# Altium project 1166V10.PrjPCB (part 1 of 2)
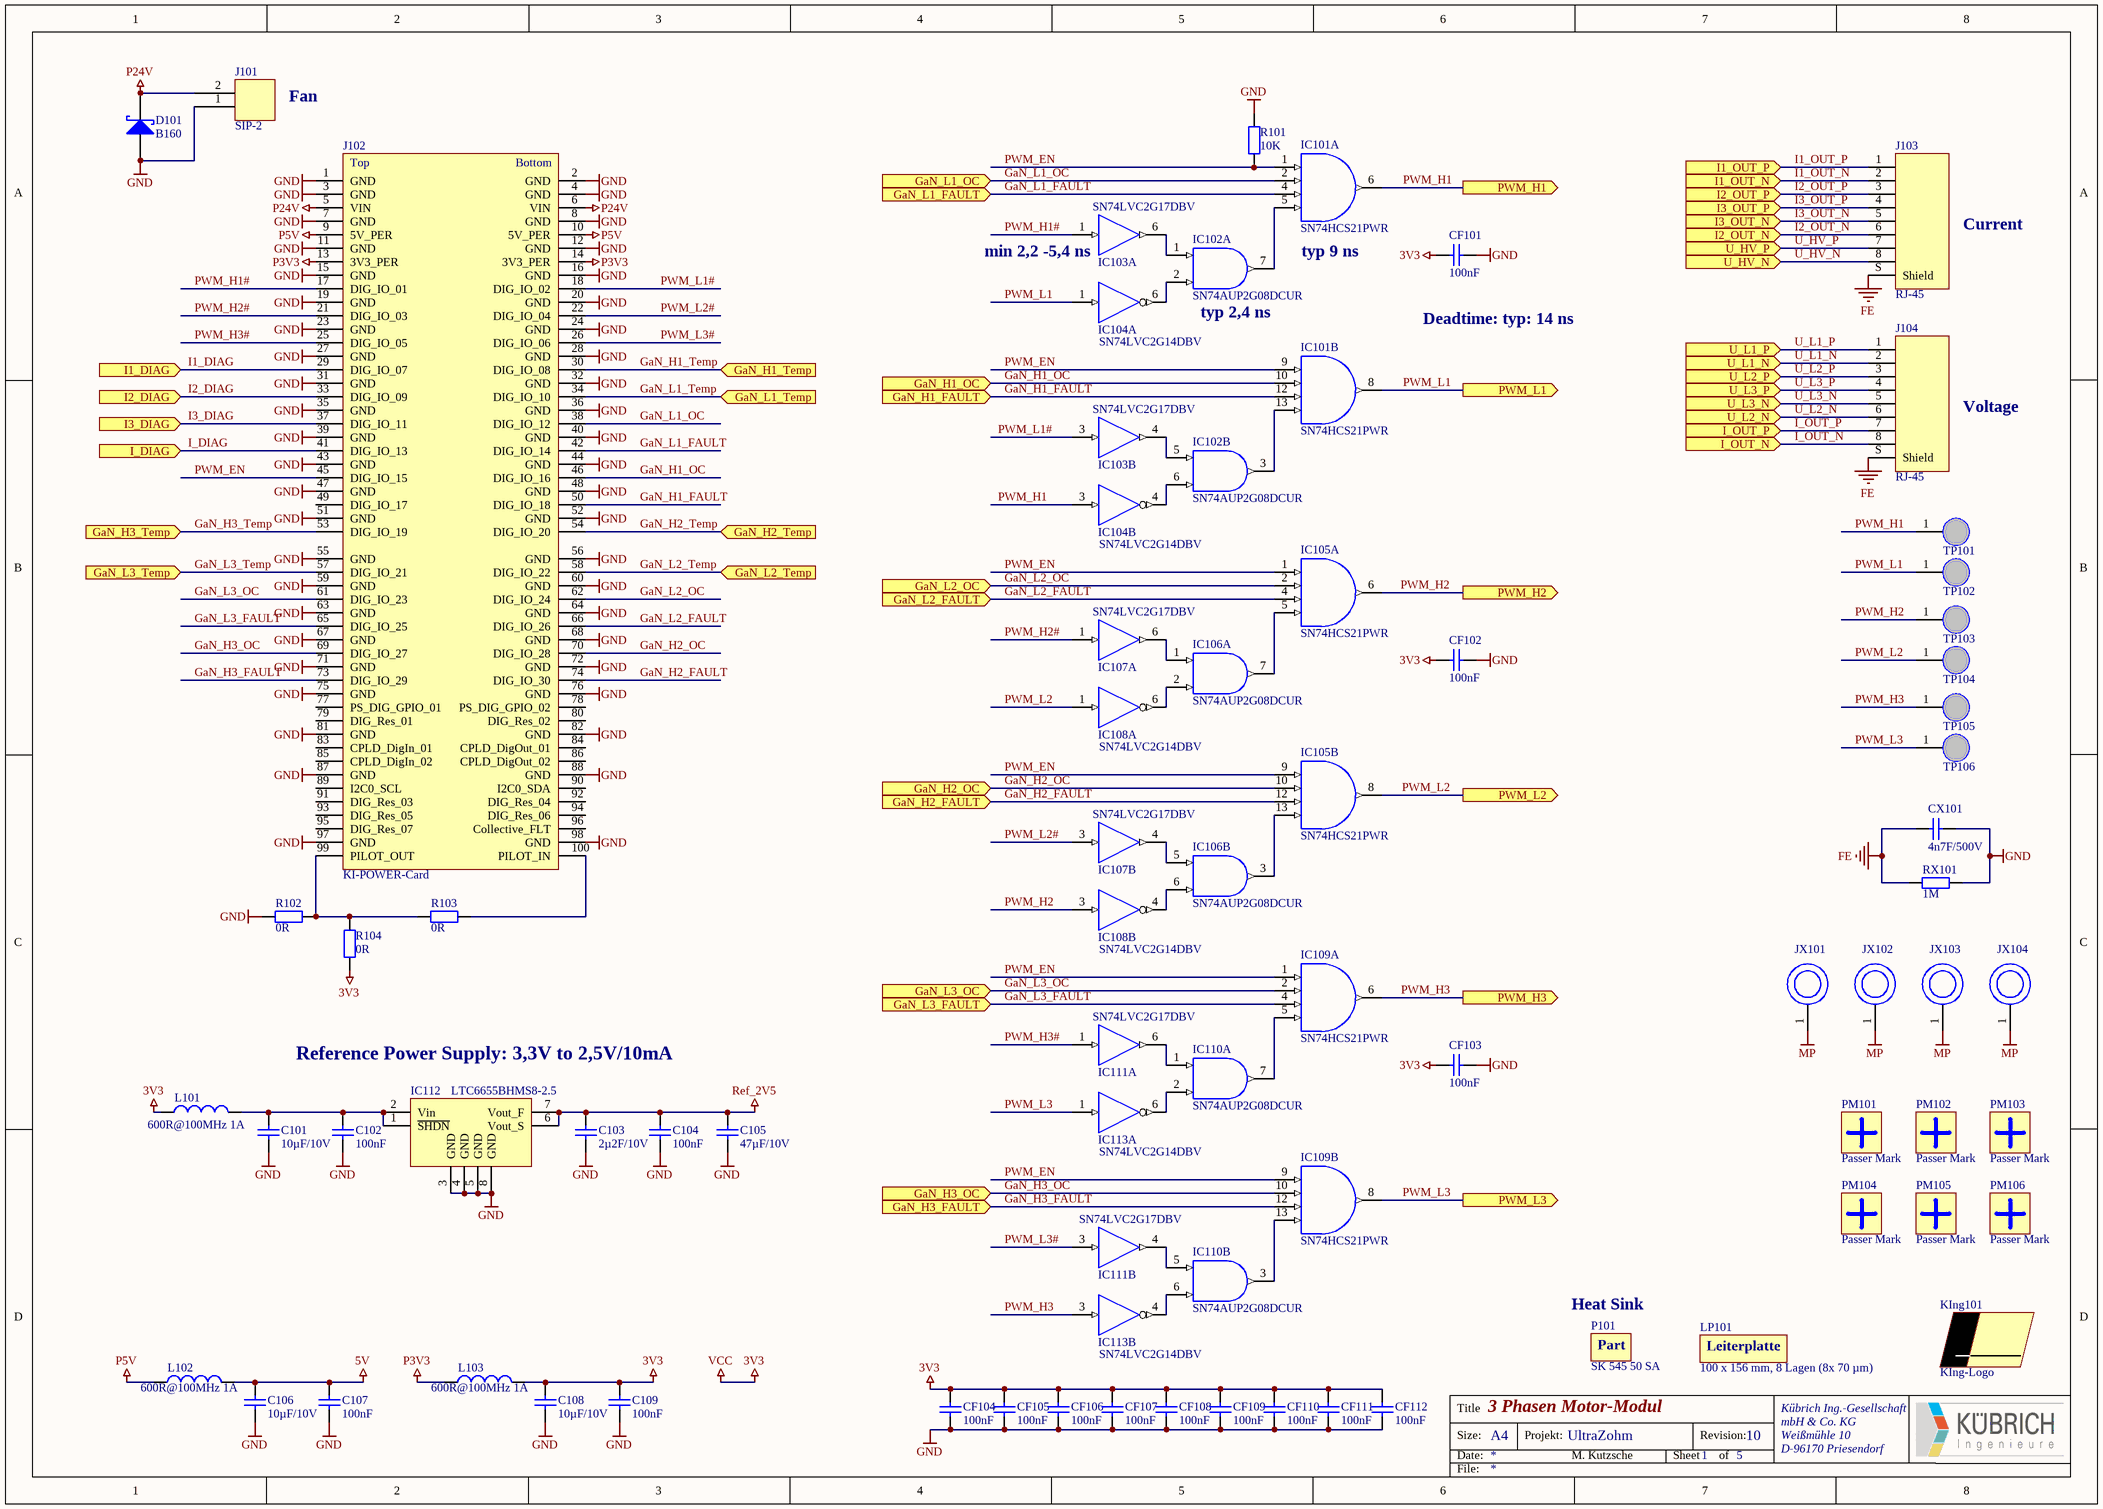
[diagram p0: 1166V10-1.SchDoc]
5 sheets, 455 parts. Net scope: flat (ports and power ports of the same name join across sheets).
Board file: 1166V10.PcbDoc
Sheets:
  1166V10-1.SchDoc
  1166V10-2.SchDoc
  1166V10-3.SchDoc
  1166V10-4.SchDoc
  1166V10-5.SchDoc

## Sheet 1166V10-1.SchDoc: 3 Phasen Motor-Modul
size A3; Author: M. Kutzsche; Organization: Kübrich Ing.-Gesellschaft; Address1: mbH & Co. KG; Address2: Weißmühle 10; Address3: D-96170 Priesendorf; DocumentNumber: UltraZohm; Revision: 10; SheetNumber: 1; SheetTotal: 5

### Parts
C101  10µF/10V  [0805-Cap]
C102  100nF  [0603-Cap]
C103  2µ2F/10V  [0805-Cap]
C104  100nF  [0603-Cap]
C105  47µF/10V  [1210-Cap]
C106  10µF/10V  [0603-Cap]
C107  100nF  [0603-Cap]
C108  10µF/10V  [0603-Cap]
C109  100nF  [0603-Cap]
CF101  100nF  [0603-Cap]
CF102  100nF  [0603-Cap]
CF103  100nF  [0603-Cap]
CF104  100nF  [0603-Cap]
CF105  100nF  [0603-Cap]
CF106  100nF  [0603-Cap]
CF107  100nF  [0603-Cap]
CF108  100nF  [0603-Cap]
CF109  100nF  [0603-Cap]
CF110  100nF  [0603-Cap]
CF111  100nF  [0603-Cap]
CF112  100nF  [0603-Cap]
CX101  4n7F/500V  [1206-Cap]
D101  B160  [SMA]
IC101  SN74HCS21PWR  [TSSOP-14]  (parts A,B of 2)
IC102  SN74AUP2G08DCUR  [VSSOP-8]  (parts A,B of 2)
IC103  SN74LVC2G17DBV  [SOT-23-6]  (parts A,B of 2)
IC104  SN74LVC2G14DBV  [SOT-23-6]  (parts A,B of 2)
IC105  SN74HCS21PWR  [TSSOP-14]  (parts A,B of 2)
IC106  SN74AUP2G08DCUR  [VSSOP-8]  (parts A,B of 2)
IC107  SN74LVC2G17DBV  [SOT-23-6]  (parts A,B of 2)
IC108  SN74LVC2G14DBV  [SOT-23-6]  (parts A,B of 2)
IC109  SN74HCS21PWR  [TSSOP-14]  (parts A,B of 2)
IC110  SN74AUP2G08DCUR  [VSSOP-8]  (parts A,B of 2)
IC111  SN74LVC2G17DBV  [SOT-23-6]  (parts A,B of 2)
IC112  LTC6655BHMS8-2.5  [MSOP-8 (RM-8)]
IC113  SN74LVC2G14DBV  [SOT-23-6]  (parts A,B of 2)
J101  SIP-2  [SIP-2]
J102  KI-POWER-Card  [KI-POWER-CARD]
J103  RJ-45  [WE-634008149821]
J104  RJ-45  [WE-634008149821]
JX101  Drill PAD  [PAD-6.0/3.2]  (value not drawn)  (no BOM)
JX102  Drill PAD  [PAD-6.0/3.2]  (value not drawn)  (no BOM)
JX103  Drill PAD  [PAD-6.0/3.2]  (value not drawn)  (no BOM)
JX104  Drill PAD  [PAD-6.0/3.2]  (value not drawn)  (no BOM)
KIng101  KIng-Logo  [King_Logo 900x300mil short]  (no BOM)
L101  600R@100MHz 1A  [0603-Ind]
L102  600R@100MHz 1A  [0603-Ind]
L103  600R@100MHz 1A  [0603-Ind]
LP101  100 x 156 mm, 8 Lagen (8x 70 µm)  [LP]
P101  SK 545 50 SA  [Part]
PM101  Passer Mark  [PASSER-MARK Rund 1,2mm]
PM102  Passer Mark  [PASSER-MARK Rund 1,2mm]
PM103  Passer Mark  [PASSER-MARK Rund 1,2mm]
PM104  Passer Mark  [PASSER-MARK Rund 1,2mm]
PM105  Passer Mark  [PASSER-MARK Rund 1,2mm]
PM106  Passer Mark  [PASSER-MARK Rund 1,2mm]
R101  10K  [0603-Res]
R102  0R  [0603-Res]
R103  0R  [0603-Res]
R104  0R  [0603-Res]
RX101  1M  [1206-Res]
TP101  Test-Point  [PAD-1.0/1.8]  (value not drawn)  (no BOM)
TP102  Test-Point  [PAD-1.0/1.8]  (value not drawn)  (no BOM)
TP103  Test-Point  [PAD-1.0/1.8]  (value not drawn)  (no BOM)
TP104  Test-Point  [PAD-1.0/1.8]  (value not drawn)  (no BOM)
TP105  Test-Point  [PAD-1.0/1.8]  (value not drawn)  (no BOM)
TP106  Test-Point  [PAD-1.0/1.8]  (value not drawn)  (no BOM)

### Ports
GaN_H1_FAULT (in), GaN_H1_OC (in), GaN_H1_Temp (in), GaN_H2_FAULT (in), GaN_H2_OC (in), GaN_H2_Temp (in), GaN_H3_FAULT (in), GaN_H3_OC (in), GaN_H3_Temp (in), GaN_L1_FAULT (in), GaN_L1_OC (in), GaN_L1_Temp (in), GaN_L2_FAULT (in), GaN_L2_OC (in), GaN_L2_Temp (in), GaN_L3_FAULT (in), GaN_L3_OC (in), GaN_L3_Temp (in), I1_DIAG (in), I1_OUT_N (in), I1_OUT_P (in), I2_DIAG (in), I2_OUT_N (in), I2_OUT_P (in), I3_DIAG (in), I3_OUT_N (in), I3_OUT_P (in), I_DIAG (in), I_OUT_N (in), I_OUT_P (in), PWM_H1 (out), PWM_H2 (out), PWM_H3 (out), PWM_L1 (out), PWM_L2 (out), PWM_L3 (out), U_HV_N (in), U_HV_P (in), U_L1_N (in), U_L1_P (in), U_L2_N (in), U_L2_P (in), U_L3_N (in), U_L3_P (in)

### Nets
3V3: C108.2 C109.2 CF101.2 CF102.2 CF103.2 CF104.1 CF105.1 CF106.1 CF107.1 CF108.1 CF109.1 CF110.1 CF111.1 CF112.1 IC101.14(VCC) IC102.8(VCC) IC103.5(VCC) IC104.5(VCC) IC105.14(VCC) IC106.8(VCC) IC107.5(VCC) IC108.5(VCC) IC109.14(VCC) IC110.8(VCC) IC111.5(VCC) IC113.5(VCC) L101.1 L103.2 R104.1  [also labelled VCC]
5V: C106.2 C107.2 L102.2
FE: CX101.1 J103.S(Shield) J104.S(Shield) RX101.1
GND: C101.1 C102.1 C103.1 C104.1 C105.1 C106.1 C107.1 C108.1 C109.1 CF101.1 CF102.1 CF103.1 CF104.2 CF105.2 CF106.2 CF107.2 CF108.2 CF109.2 CF110.2 CF111.2 CF112.2 CX101.2 D101.1(A) IC101.7(GND) IC102.4(GND) IC103.2(GND) IC104.2(GND) IC105.7(GND) IC106.4(GND) IC107.2(GND) IC108.2(GND) IC109.7(GND) IC110.4(GND) IC111.2(GND) IC112.3(GND) IC112.4(GND) IC112.5(GND) IC112.8(GND) IC113.2(GND) J101.1 J102.1(GND) J102.2(GND) J102.3(GND) J102.4(GND) J102.7(GND) J102.8(GND) J102.11(GND) J102.12(GND) J102.15(GND) J102.16(GND) J102.19(GND) J102.20(GND) J102.23(GND) J102.24(GND) J102.27(GND) J102.28(GND) J102.31(GND) J102.32(GND) J102.35(GND) J102.36(GND) J102.39(GND) J102.40(GND) J102.43(GND) J102.44(GND) J102.47(GND) J102.48(GND) J102.51(GND) J102.52(GND) J102.55(GND) J102.56(GND) J102.59(GND) J102.60(GND) J102.63(GND) J102.64(GND) J102.67(GND) J102.68(GND) J102.71(GND) J102.72(GND) J102.75(GND) J102.76(GND) J102.81(GND) J102.82(GND) J102.87(GND) J102.88(GND) J102.97(GND) J102.98(GND) R101.2 R102.1 RX101.2
MP: JX101.1 JX102.1 JX103.1 JX104.1
P3V3: J102.13(3V3_PER) J102.14(3V3_PER) L103.1
P5V: J102.9(5V_PER) J102.10(5V_PER) L102.1
P24V: D101.2(K) J101.2 J102.5(VIN) J102.6(VIN)
Ref_2V5: C103.2 C104.2 C105.2 IC112.6(Vout_S) IC112.7(Vout_F)
GaN_H1_FAULT: IC101.12(C2) J102.50(DIG_IO_18) ; port GaN_H1_FAULT
GaN_H1_OC: IC101.10(B2) J102.46(DIG_IO_16) ; port GaN_H1_OC
GaN_H1_Temp: J102.30(DIG_IO_08) ; port GaN_H1_Temp
GaN_H2_FAULT: IC105.12(C2) J102.74(DIG_IO_30) ; port GaN_H2_FAULT
GaN_H2_OC: IC105.10(B2) J102.70(DIG_IO_28) ; port GaN_H2_OC
GaN_H2_Temp: J102.54(DIG_IO_20) ; port GaN_H2_Temp
GaN_H3_FAULT: IC109.12(C2) J102.73(DIG_IO_29) ; port GaN_H3_FAULT
GaN_H3_OC: IC109.10(B2) J102.69(DIG_IO_27) ; port GaN_H3_OC
GaN_H3_Temp: J102.53(DIG_IO_19) ; port GaN_H3_Temp
GaN_L1_FAULT: IC101.4(C1) J102.42(DIG_IO_14) ; port GaN_L1_FAULT
GaN_L1_OC: IC101.2(B1) J102.38(DIG_IO_12) ; port GaN_L1_OC
GaN_L1_Temp: J102.34(DIG_IO_10) ; port GaN_L1_Temp
GaN_L2_FAULT: IC105.4(C1) J102.66(DIG_IO_26) ; port GaN_L2_FAULT
GaN_L2_OC: IC105.2(B1) J102.62(DIG_IO_24) ; port GaN_L2_OC
GaN_L2_Temp: J102.58(DIG_IO_22) ; port GaN_L2_Temp
GaN_L3_FAULT: IC109.4(C1) J102.65(DIG_IO_25) ; port GaN_L3_FAULT
GaN_L3_OC: IC109.2(B1) J102.61(DIG_IO_23) ; port GaN_L3_OC
GaN_L3_Temp: J102.57(DIG_IO_21) ; port GaN_L3_Temp
I1_DIAG: J102.29(DIG_IO_07) ; port I1_DIAG
I1_OUT_N: J103.2 ; port I1_OUT_N
I1_OUT_P: J103.1 ; port I1_OUT_P
I2_DIAG: J102.33(DIG_IO_09) ; port I2_DIAG
I2_OUT_N: J103.6 ; port I2_OUT_N
I2_OUT_P: J103.3 ; port I2_OUT_P
I3_DIAG: J102.37(DIG_IO_11) ; port I3_DIAG
I3_OUT_N: J103.5 ; port I3_OUT_N
I3_OUT_P: J103.4 ; port I3_OUT_P
I_DIAG: J102.41(DIG_IO_13) ; port I_DIAG
I_OUT_N: J104.8 ; port I_OUT_N
I_OUT_P: J104.7 ; port I_OUT_P
PWM_EN: IC101.1(A1) IC101.9(A2) IC105.1(A1) IC105.9(A2) IC109.1(A1) IC109.9(A2) J102.45(DIG_IO_15) R101.1
PWM_H1: IC101.6(O1) IC104.3(2A) TP101.1 ; port PWM_H1
PWM_H1#: IC103.1(1A) J102.17(DIG_IO_01)
PWM_H2: IC105.6(O1) IC108.3(2A) TP103.1 ; port PWM_H2
PWM_H2#: IC107.1(1A) J102.21(DIG_IO_03)
PWM_H3: IC109.6(O1) IC113.3(2A) TP105.1 ; port PWM_H3
PWM_H3#: IC111.1(1A) J102.25(DIG_IO_05)
PWM_L1: IC101.8(O2) IC104.1(1A) TP102.1 ; port PWM_L1
PWM_L1#: IC103.3(2A) J102.18(DIG_IO_02)
PWM_L2: IC105.8(O2) IC108.1(1A) TP104.1 ; port PWM_L2
PWM_L2#: IC107.3(2A) J102.22(DIG_IO_04)
PWM_L3: IC109.8(O2) IC113.1(1A) TP106.1 ; port PWM_L3
PWM_L3#: IC111.3(2A) J102.26(DIG_IO_06)
U_HV_N: J103.8 ; port U_HV_N
U_HV_P: J103.7 ; port U_HV_P
U_L1_N: J104.2 ; port U_L1_N
U_L1_P: J104.1 ; port U_L1_P
U_L2_N: J104.6 ; port U_L2_N
U_L2_P: J104.3 ; port U_L2_P
U_L3_N: J104.5 ; port U_L3_N
U_L3_P: J104.4 ; port U_L3_P
NetC101_2: C101.2 C102.2 IC112.1(~{SHDN}) IC112.2(Vin) L101.2
NetIC101_5: IC101.5(D1) IC102.7(1Y)
NetIC101_13: IC101.13(D2) IC102.3(2Y)
NetIC102_1: IC102.1(1A) IC103.6(1Y)
NetIC102_2: IC102.2(1B) IC104.6(1Y)
NetIC102_5: IC102.5(2A) IC103.4(2Y)
NetIC102_6: IC102.6(2B) IC104.4(2Y)
NetIC105_5: IC105.5(D1) IC106.7(1Y)
NetIC105_13: IC105.13(D2) IC106.3(2Y)
NetIC106_1: IC106.1(1A) IC107.6(1Y)
NetIC106_2: IC106.2(1B) IC108.6(1Y)
NetIC106_5: IC106.5(2A) IC107.4(2Y)
NetIC106_6: IC106.6(2B) IC108.4(2Y)
NetIC109_5: IC109.5(D1) IC110.7(1Y)
NetIC109_13: IC109.13(D2) IC110.3(2Y)
NetIC110_1: IC110.1(1A) IC111.6(1Y)
NetIC110_2: IC110.2(1B) IC113.6(1Y)
NetIC110_5: IC110.5(2A) IC111.4(2Y)
NetIC110_6: IC110.6(2B) IC113.4(2Y)
NetJ102_99: J102.99(PILOT_OUT) R102.2 R103.1 R104.2
NetJ102_100: J102.100(PILOT_IN) R103.2

Not connected (* = marked no-connect by the designer): J102 49(DIG_IO_17) 77(PS_DIG_GPIO_01) 78(PS_DIG_GPIO_02) 79(DIG_Res_01) 80(DIG_Res_02) 83(CPLD_DigIn_01) 84(CPLD_DigOut_01) 85(CPLD_DigIn_02) 86(CPLD_DigOut_02) 89(I2C0_SCL) 90(I2C0_SDA) 91(DIG_Res_03) 92(DIG_Res_04) 93(DIG_Res_05) 94(DIG_Res_06) 95(DIG_Res_07) 96(Collective_FLT)

### Notes on the sheet
- Fan
- Current
- (near IC103) min 2,2 -5,4 ns
- (near IC102) typ 2,4 ns
- typ 9 ns
- Deadtime: typ: 14 ns
- Voltage
- Reference Power Supply: 3,3V to 2,5V/10mA
- Heat Sink
- Title
- Size:
- Date:
- A4
- Projekt:
- Sheet
- Revision:
- of
- File:
- (in symbol KI-POWER-Card) Top; Bottom

### Library data of the parts
C101-C109 CF101-CF112 CX101 = Cap_SMD: Capacitor (SMD); Class I: Pasiv; Class II: Capacitor; Last edited: 20.11.2006 10:25
  C101 C106 C108: value: 10µF/10V
  C102 C104 C107 C109 CF101-CF112: value: 100nF
  C103: value: 2µ2F/10V
  C105: value: 47µF/10V
  CX101: value: 4n7F/500V
D101 = B160: Schottky Barrier Rectifier Vr=60V If=1A; Manufacturer: General Semiconductor; Class II: Schottky Earrier Rectifier Vr=60V If=1A; Class I: Discret; Package information: Unknown; Best.-Nr.: Farnell 145-6528RL; Datasheet: Ver. 7 Nov 2000; Package reference: DO-214AC (SMA)
IC101 IC105 IC109 = SN74HCS21PWR: Dual 4-Input AND Gate with Schmitt Trigger Input; Manufacturer: Texas Instrument; Package Information: Unknown; Class I: Logic; Best.-Nr.: DigiKey: 296-SN74HCS21PWRCT-ND; Datasheet: SCES200J; Package Reference: TSSOP-14; Class II: Gate
IC102 IC106 IC110 = SN74AUP2G08DCUR: (VSSOP) Dual 2-Input Positive AND Gate; Manufacturer: Texas Instrument; Package Information: Unknown; Class I: Logic; Datasheet: SCES193J, Rev. Sep 2003; Package Reference: VSSOP-8; Class II: Dual 2-Input Positive AND Gate
IC103 IC107 IC111 = SN74LVC2G17D_: Dual Buffer with Schmitt Trigger Input; Manufacturer: Texas Instrument; Class I: Logic; value121: SN74LVC2G17DCK; Best.-Nr.: Farnell 147-0776 (SOT23-6), 128-7569 (SC-70); Datasheet: SCES381E, Rev. Sep 2003; Class II: Dual Buffer with Schmitt Trigger Input; value111: SN74LVC2G17DBV; Last edited: 22.01.2007 11:08
IC104 IC108 IC113 = SN74LVC2G14D_: Dual Inverter with Schmitt Trigger Input; Manufacturer: Texas Instrument; Class I: Logic; value121: SN74LVC2G14DCK; Datasheet: SCES200J; Class II: Dual Inverter with Schmitt Trigger Input; value111: SN74LVC2G14DBV; Last edited: 22.01.2007 11:08
IC112 = LTC6655BHMS8-2.5: Voltage References 2,5V, 2ppm/°C, Low Noise 0,25ppm; Manufacturer: Linear Technology; Class I: Discret; Package information: Unknown; Best.-Nr.: Farnell 229-5508; Class II: Voltage References 2,5V, 2ppm/°C, Low Noise 0,25ppm; Datasheet: Unknown; Package reference: MSOP-8
J101 = SIP-2: Single In-line Connector 2 pin; Class I: Connectors; Class II: Single In-line Connector 2 pin; Last edited: 08.12.2006 17:09
J102 = KI-POWER-Card: Einsteckkarte für KI-POWER Projekt (Ultra ZYNQ); Manufacturer: Samtec; Class I: Connectors; Best.-Nr.: Gegenstecker: Samtec HSEC8-150-01-XX-DV-A-BL; Class II: Einsteckkarte für KI-POWER Projekt (Ultra ZYNQ); Datasheet: 2000/1; Last edited: 07.09.2020 13:28
J103 J104 = WE-634008149821: SMD CAT3 RJ-45 Connector; Manufacturer: Würth Elektronik; Class I: Connectors; Class II: RJ-45 Connector; Package reference: WE-634008149821; Datasheet: Unknown; Best.-Nr.: WE-634008149821
JX101-JX104 = Drill PAD: PAD
KIng101 = KIng-Logo: Kuebrich-Ing. Logo
L101-L103 = WE-742792651: Ferrite SMD 600R@100MHz 1A (0603); Manufacturer: Wuerth-Elektronik; Class I: Pasive; Class II: Ferrite SMD 600R@100MHz 1A; Last edited: 08.12.2006 12:28; Best.-Nr.: WE-742792651
LP101 = Leiterplatte: Leiterplatte 100 x 156 mm, 8 Lagen (8x 70 µm); Manufacturer: Generic Manufacturer; Footprint: Größe 100 x 156 mm
P101 = Part: Kühlkörper 80x50x10 mm; Manufacturer: Fischer Elektronik; Best.-Nr.: SK 545 50 SA
R101-R104 RX101 = Res_SMD: Resistor SMD; Class I: Pasiv; Class II: Resistor; Last edited: 17.11.2006 11:38
  R101: value: 10K
  R102-R104: value: 0R
  RX101: value: 1M
TP101-TP106 = Test-Point: PAD

## Sheet 1166V10-2.SchDoc: Half-Bridge Phase 1
size A3; Author: M. Kutzsche; Organization: Kübrich Ing.-Gesellschaft; Address1: mbH & Co. KG; Address2: Weißmühle 10; Address3: D-96170 Priesendorf; DocumentNumber: UltraZohm; Revision: 10; SheetNumber: 2; SheetTotal: 5
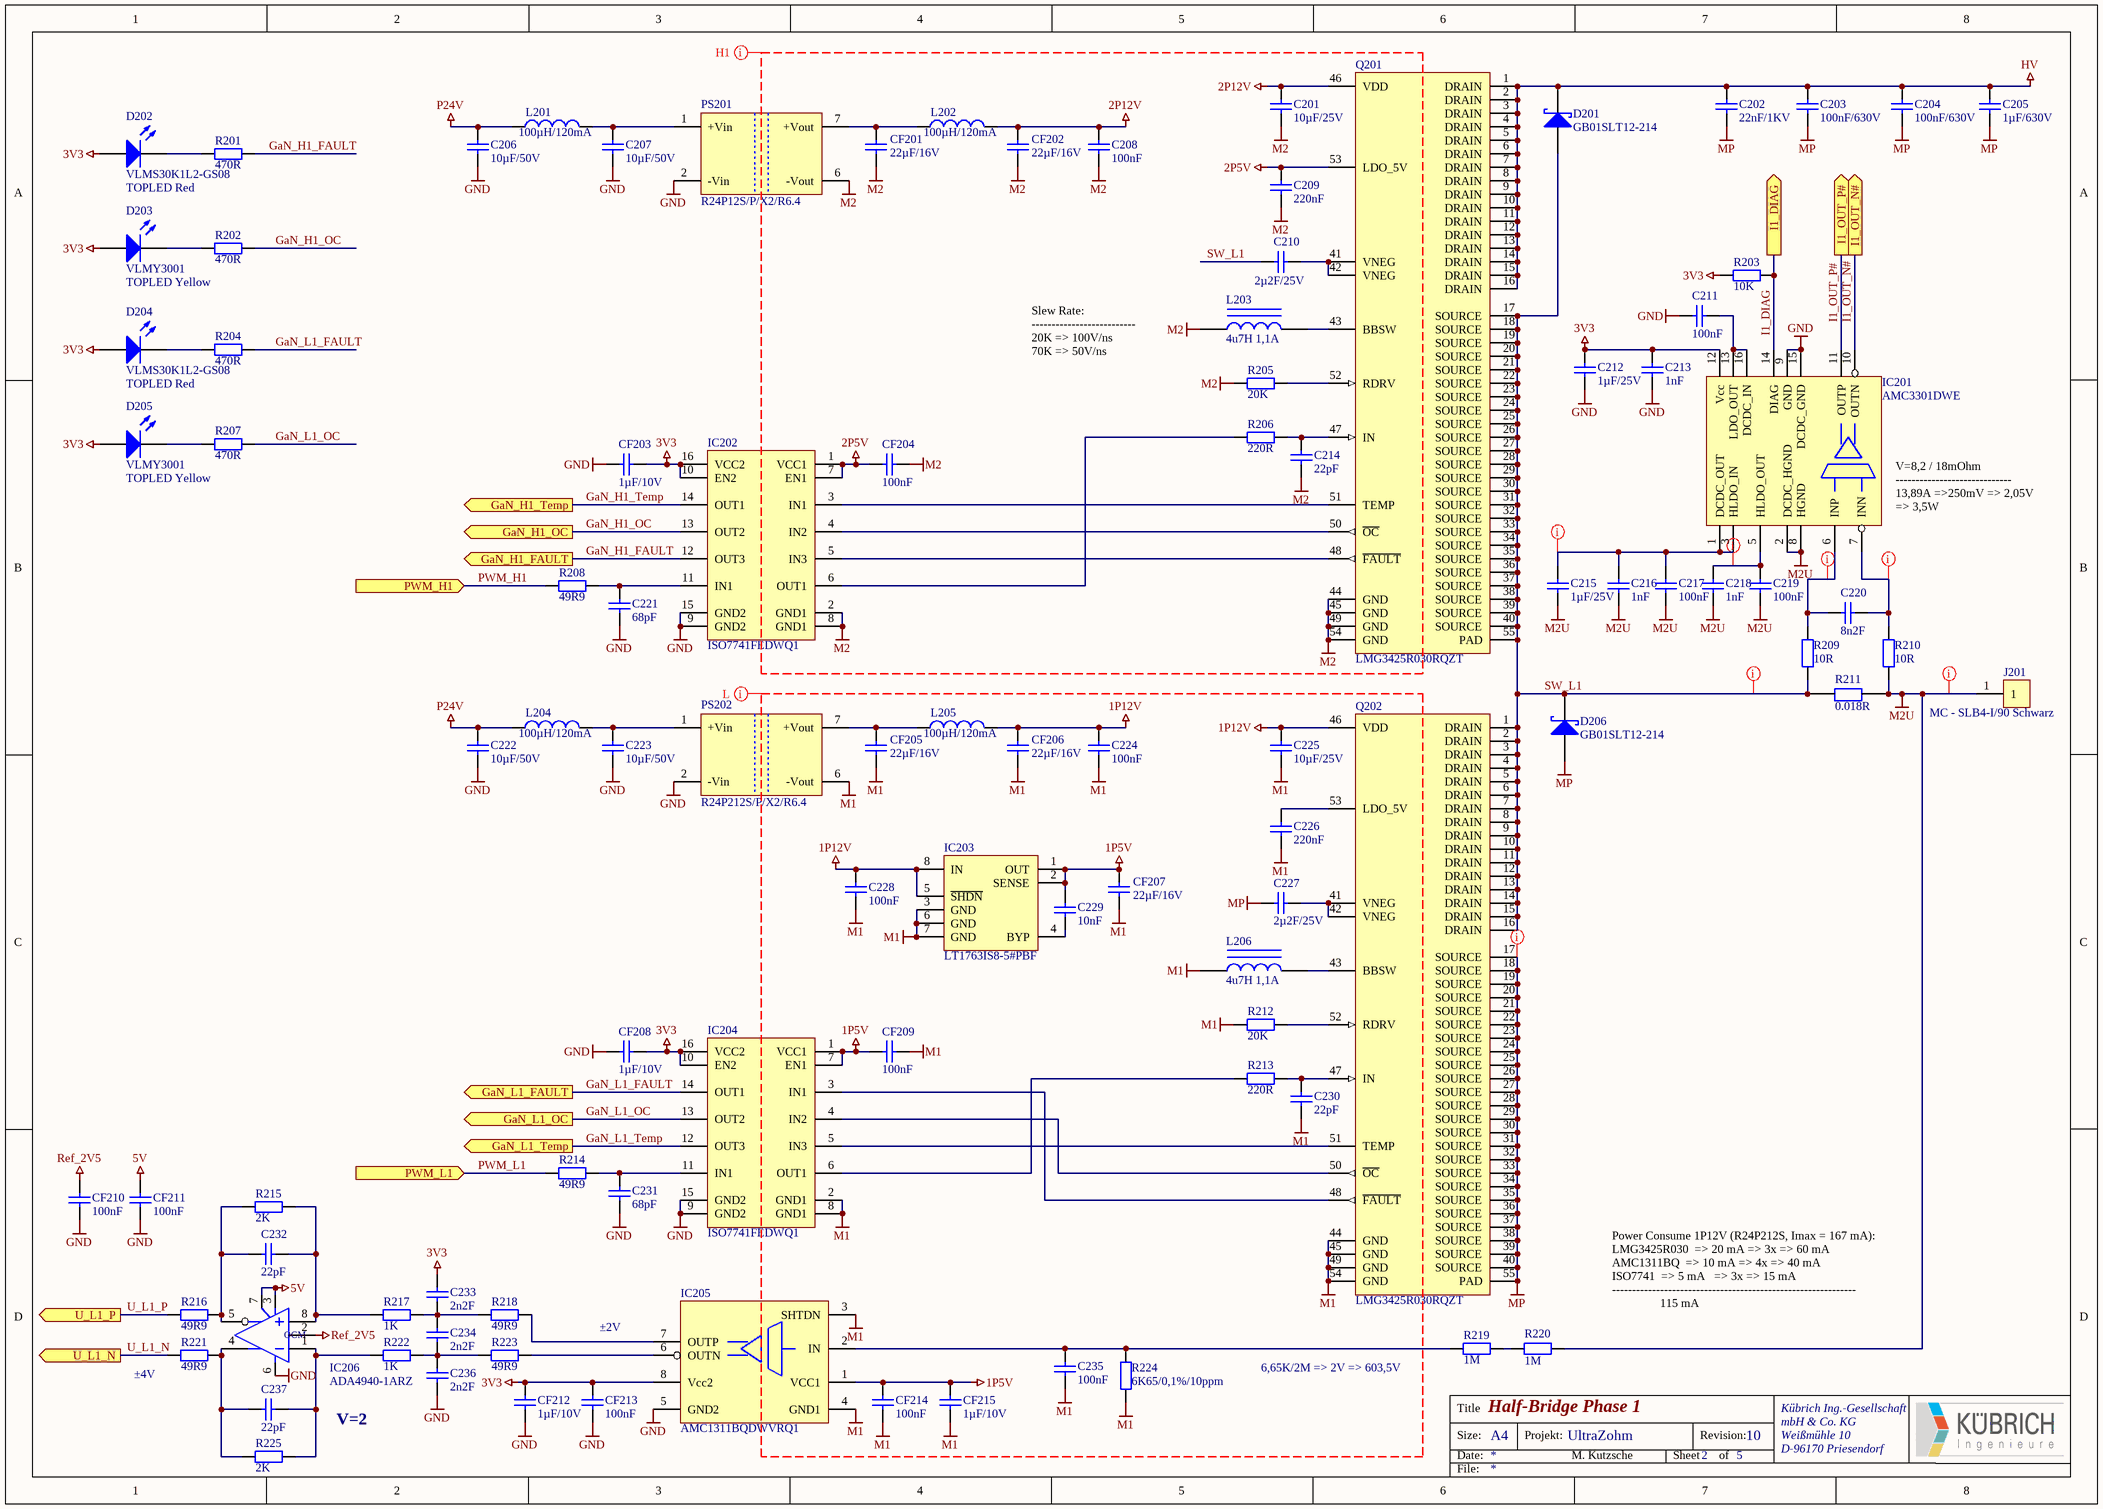
[diagram p1: 1166V10-2.SchDoc]

### Parts
C201  10µF/25V  [0805-Cap]
C202  22nF/1KV  [2220-Cap]
C203  100nF/630V  [2220-Cap]
C204  100nF/630V  [2220-Cap]
C205  1µF/630V  [2220-Cap]
C206  10µF/50V  [1206-Cap]
C207  10µF/50V  [1206-Cap]
C208  100nF  [0603-Cap]
C209  220nF  [0603-Cap]
C210  2µ2F/25V  [0805-Cap]
C211  100nF  [0603-Cap]
C212  1µF/25V  [1206-Cap]
C213  1nF  [1206-Cap]
C214  22pF  [0603-Cap]
C215  1µF/25V  [0603-Cap]
C216  1nF  [0603-Cap]
C217  100nF  [0603-Cap]
C218  1nF  [1206-Cap]
C219  100nF  [1206-Cap]
C220  8n2F  [0603-Cap]
C221  68pF  [0603-Cap]
C222  10µF/50V  [1206-Cap]
C223  10µF/50V  [1206-Cap]
C224  100nF  [0603-Cap]
C225  10µF/25V  [0805-Cap]
C226  220nF  [0603-Cap]
C227  2µ2F/25V  [0805-Cap]
C228  100nF  [0603-Cap]
C229  10nF  [0603-Cap]
C230  22pF  [0603-Cap]
C231  68pF  [0603-Cap]
C232  22pF  [0603-Cap]
C233  2n2F  [0603-Cap]
C234  2n2F  [0603-Cap]
C235  100nF  [0603-Cap]
C236  2n2F  [0603-Cap]
C237  22pF  [0603-Cap]
CF201  22µF/16V  [0805-Cap]
CF202  22µF/16V  [0805-Cap]
CF203  1µF/10V  [0603-Cap]
CF204  100nF  [0603-Cap]
CF205  22µF/16V  [0805-Cap]
CF206  22µF/16V  [0805-Cap]
CF207  22µF/16V  [0805-Cap]
CF208  1µF/10V  [0603-Cap]
CF209  100nF  [0603-Cap]
CF210  100nF  [0603-Cap]
CF211  100nF  [0603-Cap]
CF212  1µF/10V  [0603-Cap]
CF213  100nF  [0603-Cap]
CF214  100nF  [0603-Cap]
CF215  1µF/10V  [0603-Cap]
D201  GB01SLT12-214  [DO-214 (SMB)]
D202  VLMS30K1L2-GS08  Class II: TOPLED Red  [PLCC-2_rot]
D203  VLMY3001  Class II: TOPLED Yellow  [PLCC-2_gelb]
D204  VLMS30K1L2-GS08  Class II: TOPLED Red  [PLCC-2_rot]
D205  VLMY3001  Class II: TOPLED Yellow  [PLCC-2_gelb]
D206  GB01SLT12-214  [DO-214 (SMB)]
IC201  AMC3301DWE  [SOIC-16-W - 8.1mm]
IC202  ISO7741FEDWQ1  [SOIC-16-W - 8.1mm]
IC203  LT1763IS8-5#PBF  [SOIC-8-N]
IC204  ISO7741FEDWQ1  [SOIC-16-W - 8.1mm]
IC205  AMC1311BQDWVRQ1  [SOIC-8-W]
IC206  ADA4940-1ARZ  [SOIC-8-N]
J201  MC - SLB4-I/90 Schwarz  [SLB4-I/90 - 4mm]
L201  100µH/120mA  [1007-IND (2518)]
L202  100µH/120mA  [1007-IND (2518)]
L203  4u7H 1,1A  [2.0mm x 1.6mm]
L204  100µH/120mA  [1007-IND (2518)]
L205  100µH/120mA  [1007-IND (2518)]
L206  4u7H 1,1A  [2.0mm x 1.6mm]
PS201  R24P12S/P/X2/R6.4  [SIP-7 Single - X2]
PS202  R24P212S/P/X2/R6.4  [SIP-7 Single - X2]
Q201  LMG3425R030RQZT  [VQFN-54 (RQZ0054)]
Q202  LMG3425R030RQZT  [VQFN-54 (RQZ0054)]
R201  470R  [0603-Res]
R202  470R  [0603-Res]
R203  10K  [0603-Res]
R204  470R  [0603-Res]
R205  20K  [0603-Res]
R206  220R  [0603-Res]
R207  470R  [0603-Res]
R208  49R9  [0603-Res]
R209  10R  [0603-Res]
R210  10R  [0603-Res]
R211  0.018R  [2512]
R212  20K  [0603-Res]
R213  220R  [0603-Res]
R214  49R9  [0603-Res]
R215  2K  [0603-Res]
R216  49R9  [0603-Res]
R217  1K  [0603-Res]
R218  49R9  [0603-Res]
R219  1M  [2512-Res]
R220  1M  [2512-Res]
R221  49R9  [0603-Res]
R222  1K  [0603-Res]
R223  49R9  [0603-Res]
R224  6K65/0,1%/10ppm  [0603-Res]
R225  2K  [0603-Res]

### Ports
GaN_H1_FAULT (out), GaN_H1_OC (out), GaN_H1_Temp (out), GaN_L1_FAULT (out), GaN_L1_OC (out), GaN_L1_Temp (out), I1_DIAG (out), I1_OUT_N# (out), I1_OUT_P# (out), PWM_H1 (in), PWM_L1 (in), U_L1_N (out), U_L1_P (out)

### Nets
1P5V: C229.1 CF207.1 CF209.2 CF214.1 CF215.1 IC203.1(OUT) IC203.2(SENSE) IC204.1(VCC1) IC204.7(EN1) IC205.1(VCC1)
1P12V: C224.1 C225.2 C228.1 CF206.1 IC203.5(~{SHDN}) IC203.8(IN) L205.2 Q202.46(VDD)
2P5V: C209.2 CF204.2 IC202.1(VCC1) IC202.7(EN1) Q201.53(LDO_5V)
2P12V: C201.2 C208.1 CF202.1 L202.2 Q201.46(VDD)
3V3: C212.1 C213.1 C233.2 CF203.1 CF208.1 CF212.1 CF213.1 D202.1(A) D203.1(A) D204.1(A) D205.1(A) IC201.12(Vcc) IC202.10(EN2) IC202.16(VCC2) IC204.10(EN2) IC204.16(VCC2) IC205.8(Vcc2) R203.2
5V: CF211.1 IC206.3(V+) IC206.7(EN)
GND: C206.1 C207.1 C211.1 C212.2 C213.2 C221.1 C222.1 C223.1 C231.1 C236.1 CF203.2 CF208.2 CF210.2 CF211.2 CF212.2 CF213.2 IC201.9(GND) IC201.15(DCDC_GND) IC202.9(GND2) IC202.15(GND2) IC204.9(GND2) IC204.15(GND2) IC205.5(GND2) IC206.6(V-) PS201.2(-Vin) PS202.2(-Vin)
HV: C202.1 C203.1 C204.1 C205.1 D201.2(K) Q201.1(DRAIN) Q201.2(DRAIN) Q201.3(DRAIN) Q201.4(DRAIN) Q201.5(DRAIN) Q201.6(DRAIN) Q201.7(DRAIN) Q201.8(DRAIN) Q201.9(DRAIN) Q201.10(DRAIN) Q201.11(DRAIN) Q201.12(DRAIN) Q201.13(DRAIN) Q201.14(DRAIN) Q201.15(DRAIN) Q201.16(DRAIN)
M1: C224.2 C225.1 C226.1 C228.2 C230.1 C235.1 CF205.2 CF206.2 CF207.2 CF209.1 CF214.2 CF215.2 IC203.3(GND) IC203.6(GND) IC203.7(GND) IC204.2(GND1) IC204.8(GND1) IC205.3(SHTDN) IC205.4(GND1) L206.1 PS202.6(-Vout) Q202.44(GND) Q202.45(GND) Q202.49(GND) Q202.54(GND) R212.2 R224.2
M2: C201.1 C208.2 C209.1 C214.1 CF201.2 CF202.2 CF204.1 IC202.2(GND1) IC202.8(GND1) L203.1 PS201.6(-Vout) Q201.44(GND) Q201.45(GND) Q201.49(GND) Q201.54(GND) R205.2
M2U: C215.2 C216.2 C217.2 C218.2 C219.2 IC201.2(DCDC_HGND) IC201.8(HGND) J201.1 R210.1 R211.2 R220.2
MP: C202.2 C203.2 C204.2 C205.2 C227.2 D206.1(A) Q202.17(SOURCE) Q202.18(SOURCE) Q202.19(SOURCE) Q202.20(SOURCE) Q202.21(SOURCE) Q202.22(SOURCE) Q202.23(SOURCE) Q202.24(SOURCE) Q202.25(SOURCE) Q202.26(SOURCE) Q202.27(SOURCE) Q202.28(SOURCE) Q202.29(SOURCE) Q202.30(SOURCE) Q202.31(SOURCE) Q202.32(SOURCE) Q202.33(SOURCE) Q202.34(SOURCE) Q202.35(SOURCE) Q202.36(SOURCE) Q202.37(SOURCE) Q202.38(SOURCE) Q202.39(SOURCE) Q202.40(SOURCE) Q202.55(PAD)
P24V: C206.2 C222.2 L201.1 L204.1
Ref_2V5: CF210.1 IC206.2(OCM)
GaN_H1_FAULT: IC202.12(OUT3) R201.2 ; port GaN_H1_FAULT
GaN_H1_OC: IC202.13(OUT2) R202.2 ; port GaN_H1_OC
GaN_H1_Temp: IC202.14(OUT1) ; port GaN_H1_Temp
GaN_L1_FAULT: IC204.14(OUT1) R204.2 ; port GaN_L1_FAULT
GaN_L1_OC: IC204.13(OUT2) R207.2 ; port GaN_L1_OC
GaN_L1_Temp: IC204.12(OUT3) ; port GaN_L1_Temp
I1_DIAG: IC201.14(DIAG) R203.1 ; port I1_DIAG
I1_OUT_N#: IC201.10(OUTN) ; port I1_OUT_N#
I1_OUT_P#: IC201.11(OUTP) ; port I1_OUT_P#
PWM_H1: R208.2 ; port PWM_H1
PWM_L1: R214.2 ; port PWM_L1
SW_L1: C210.1 D201.1(A) D206.2(K) Q201.17(SOURCE) Q201.18(SOURCE) Q201.19(SOURCE) Q201.20(SOURCE) Q201.21(SOURCE) Q201.22(SOURCE) Q201.23(SOURCE) Q201.24(SOURCE) Q201.25(SOURCE) Q201.26(SOURCE) Q201.27(SOURCE) Q201.28(SOURCE) Q201.29(SOURCE) Q201.30(SOURCE) Q201.31(SOURCE) Q201.32(SOURCE) Q201.33(SOURCE) Q201.34(SOURCE) Q201.35(SOURCE) Q201.36(SOURCE) Q201.37(SOURCE) Q201.38(SOURCE) Q201.39(SOURCE) Q201.40(SOURCE) Q201.55(PAD) Q202.1(DRAIN) Q202.2(DRAIN) Q202.3(DRAIN) Q202.4(DRAIN) Q202.5(DRAIN) Q202.6(DRAIN) Q202.7(DRAIN) Q202.8(DRAIN) Q202.9(DRAIN) Q202.10(DRAIN) Q202.11(DRAIN) Q202.12(DRAIN) Q202.13(DRAIN) Q202.14(DRAIN) Q202.15(DRAIN) Q202.16(DRAIN) R209.1 R211.1
U_L1_N: R221.2 ; port U_L1_N
U_L1_P: R216.2 ; port U_L1_P
NetC207_2: C207.2 L201.2 PS201.1(+Vin)
NetC210_2: C210.2 Q201.41(VNEG) Q201.42(VNEG)
NetC211_2: C211.2 IC201.13(LDO_OUT) IC201.16(DCDC_IN)
NetC214_2: C214.2 Q201.47(IN) R206.1
NetC215_1: C215.1 C216.1 C217.1 IC201.1(DCDC_OUT) IC201.3(HLDO_IN)
NetC218_1: C218.1 C219.1 IC201.5(HLDO_OUT)
NetC220_1: C220.1 IC201.7(INN) R210.2
NetC220_2: C220.2 IC201.6(INP) R209.2
NetC221_2: C221.2 IC202.11(IN1) R208.1
NetC223_2: C223.2 L204.2 PS202.1(+Vin)
NetC226_2: C226.2 Q202.53(LDO_5V)
NetC227_1: C227.1 Q202.41(VNEG) Q202.42(VNEG)
NetC229_2: C229.2 IC203.4(BYP)
NetC230_2: C230.2 Q202.47(IN) R213.1
NetC231_2: C231.2 IC204.11(IN1) R214.1
NetC232_1: C232.1 IC206.8(+) R215.1 R217.2
NetC232_2: C232.2 IC206.5(Out) R215.2 R216.1
NetC233_1: C233.1 C234.2 R217.1 R218.2
NetC234_1: C234.1 C236.2 R222.1 R223.2
NetC235_2: C235.2 IC205.2(IN) R219.1 R224.1
NetC237_1: C237.1 IC206.1(-) R222.2 R225.1
NetC237_2: C237.2 IC206.4(Out) R221.1 R225.2
NetCF201_1: CF201.1 L202.1 PS201.7(+Vout)
NetCF205_1: CF205.1 L205.1 PS202.7(+Vout)
NetD202_2: D202.2(K) R201.1
NetD203_2: D203.2(K) R202.1
NetD204_2: D204.2(K) R204.1
NetD205_2: D205.2(K) R207.1
NetIC202_3: IC202.3(IN1) Q201.51(TEMP)
NetIC202_4: IC202.4(IN2) Q201.50(~{OC})
NetIC202_5: IC202.5(IN3) Q201.48(~{FAULT})
NetIC202_6: IC202.6(OUT1) R206.2
NetIC204_3: IC204.3(IN1) Q202.48(~{FAULT})
NetIC204_4: IC204.4(IN2) Q202.50(~{OC})
NetIC204_5: IC204.5(IN3) Q202.51(TEMP)
NetIC204_6: IC204.6(OUT1) R213.2
NetIC205_6: IC205.6(OUTN) R223.1
NetIC205_7: IC205.7(OUTP) R218.1
NetL203_2: L203.2 Q201.43(BBSW)
NetL206_2: L206.2 Q202.43(BBSW)
NetQ201_52: Q201.52(RDRV) R205.1
NetQ202_52: Q202.52(RDRV) R212.1
NetR219_2: R219.2 R220.1

### Layout directives
net class H1: 2P5V, 2P12V, M2, M2U, NetC215_1, NetC218_1, NetC220_1, NetC220_2, SW_L1
net class L: 1P5V, 1P12V, M1, MP

### Notes on the sheet
- Slew Rate:
  --------------------------
  20K => 100V/ns
  70K => 50V/ns
- (near IC201) V=8,2 / 18mOhm
  -----------------------------
  13,89A =>250mV => 2,05V
  => 3,5W
- Power Consume 1P12V (R24P212S, Imax = 167 mA):
  LMG3425R030 	=> 20 mA => 3x => 60 mA
  AMC1311BQ 	=> 10 mA => 4x => 40 mA
  ISO7741		=> 5 mA   => 3x => 15 mA
  -------------------------------------------------------------
  115 mA
- (near R221) ±4V
- ±2V
- 6,65K/2M => 2V => 603,5V
- V=2
- Title
- Size:
- Date:
- A4
- Projekt:
- Sheet
- Revision:
- of
- File:

### Library data of the parts
C201-C237 CF201-CF215 = Cap_SMD: Capacitor (SMD); Class I: Pasiv; Class II: Capacitor; Last edited: 20.11.2006 10:25
  C201 C225: value: 10µF/25V
  C202: value: 22nF/1KV
  C203 C204: value: 100nF/630V
  C205: value: 1µF/630V
  C206 C207 C222 C223: value: 10µF/50V
  C208 C211 C217 C219 C224 C228 C235 CF204 CF209-CF211 CF213 CF214: value: 100nF
  C209 C226: value: 220nF
  C210 C227: value: 2µ2F/25V
  C212 C215: value: 1µF/25V
  C213 C216 C218: value: 1nF
  C214 C230 C232 C237: value: 22pF
  C220: value: 8n2F
  C221 C231: value: 68pF
  C229: value: 10nF
  C233 C234 C236: value: 2n2F
  CF201 CF202 CF205-CF207: value: 22µF/16V
  CF203 CF208 CF212 CF215: value: 1µF/10V
D201 D206 = GB01SLT12-214: Silicon Carbide Schottky Diode Vr=1200V If=1A; Manufacturer: GeneSiC Semiconductor; Class I: Discret; Package information: Unknown; Best.-Nr.: DigiKey: 1242-1169-1-ND; Class II: Silicon Carbide Schottky Diode Vr=1200V If=1A; Datasheet: Ver. 7 Nov 2000; Package reference: DO-214AA (SMB)
D202 D204 = VLMS30K1L2-GS08: Top LED Super red, 2mA, 18mcd, -40-100°C; Manufacturer: Vishay; Class I: Discrete; Best.-Nr.: Farnell 132-8349; Last edited: 23.01.2007 08:58
D203 D205 = VLMY3001: Top LED Yellow, 2mA, 18mcd, -40-100°C; Manufacturer: Vishay; Class I: Discrete; Best.-Nr.: ???; Last edited: 23.01.2007 08:58
IC201 = AMC3301DWE: ±250 mV Input Voltage Range, Reinforced Isolated Amplifier and High Bandwidth of 300 kHz; Manufacturer: Texas Instruments; Class II: ±250 mV, 300KHz, -40-125°C; Package information: Unknown; Best.-Nr.: DigiKey: 296-AMC3301DWE-ND; Class I: Isolated Amplifier; Datasheet: Unknown; Package reference: SOIC-16-W
IC202 IC204 = ISO7741FEDWQ1: Quad-CH 100Mbps Isolators 1 IN/3 OUT, 5000V Reinforced, (-40-150°C); Manufacturer: Anaolog Devices; Class I: Optocoupler; Package information: Unknown; Best.-Nr.: DigiKey: 296-ISO7741FEDWQ1-ND; Class II: Quad-CH 100Mbps Isolators 1 IN/3 OUT, 5000V Reinforced, (-40-150°C); Datasheet: Unknown; Package reference: SOIC-16W
IC203 = LT1763IS8-5#PBF: LDO 5V/500mA, Vin 20V (-40-125°C); Manufacturer: Linear Technology; Class I: Discret; Package information: Unknown; Best.-Nr.: Farnell 229-5214; Class II: LDO 5V/500mA, Vin 20V (-40-125°C); Datasheet: ???; Package reference: SO-8
IC205 = AMC1311BQDWVRQ1: 2V Input, Automotive High-Impedance, Reinforced Isolated Amplifier for Voltage Sensing; Manufacturer: Texas Instruments; Class II: 2V, 275KHz, -40-125°C; Package information: Unknown; Best.-Nr.: Mouser: 595-AMC1311BQDWVRQ1; Class I: Isolated Amplifier; Datasheet: Unknown; Package reference: SOIC-8-W
IC206 = ADA4940-1ARZ: Fully Differential ADC Drivers (-40-125°C); Manufacturer: ANALOG DEVICES; Class I: Analog; Best.-Nr.: Farnell 209-6178; Class II: Fully Differential ADC Drivers (-40-125°C); Datasheet: DSO11449, Ver. Aug 2000; Last edited: 04.01.2007 10:14; Package Reference: SOIC-N-8
J201 = MC - SLB4-I/90 Schwarz: Labor Winkelbuchsen 4mm Schwarz; Manufacturer: Multi-Contact; Class I: Connectors; Best.-Nr.: Farnell: 108-5521; Class II: Labor Winkelbuchsen 4mm Schwarz; Last edited: 07.03.2007 13:28
L201 L202 L204 L205 = CB2518T101K: 100µH, 60/120mA. (1007), -40-105°C; Manufacturer: Taiyo Yuden; Class I: Pasive; Best.-Nr.: DigiKey:   587-2192-1-ND; Class II: 100µH, 60/120mA. (1007), -40-105°C; Last edited: 08.12.2006 12:28
L203 L206 = SDEM20161T-4R7MS: Power Choke 4u7H 1,1A; Manufacturer: Delta Electronics/Cyntec; Class I: Pasive; Best.-Nr.: DigiKey: 2037-SDEM20161T-4R7MSCT-ND; Class II: Power Choke 4u7H 1,1A; Last edited: 15.03.2007 11:19
PS201 = R24P12S/P/X2/R6.4: DC/DC Converter 24V to 12V, 1W, 84mA (unregulated) 6,4KVDC Rainforced; Manufacturer: Recom; Class I: Analog; Package information: Unknown; Best.-Nr.: Mouser: 919-R24P12SX2PR6.4; Class II: DC/DC Converter 24V to 12V, 1W, 84mA (unregulated) 6,4KVDC Rainforced; Package reference: SIP-7; Datasheet: Rev. 28 Apr 2002
PS202 = R24P212S/P/X2/R6.4: DC/DC Converter 24V to 12V, 2W, 167mA (unregulated) 6,4KVDC Rainforced; Manufacturer: Recom; Class I: Analog; Package information: Unknown; Best.-Nr.: Mouser: 919-R24P212SX2PR6.4; Class II: DC/DC Converter 24V to 12V, 2W, 167mA (unregulated) 6,4KVDC Rainforced; Package reference: SIP-7; Datasheet: Rev. 28 Apr 2002
Q201 Q202 = LMG3425R030RQZT: GaN FET Power Stage With Cycle-by-cycle Overcurrent Protection 600V/40A/30mOhm; Manufacturer: Texas Instruments; Class I: Discret; Package information: Unknown; Best.-Nr.: TI-Shop; Class II: GaN FET Power Stage With Cycle-by-cycle Overcurrent Protection 600V/40A/30mOhm; Datasheet: LMG3425R030; Package reference: VQFN-32
R201-R210 R212-R218 R221-R225 = Res_SMD: Resistor SMD; Class I: Pasiv; Class II: Resistor; Last edited: 17.11.2006 11:38
  R201 R202 R204 R207: value: 470R
  R203: value: 10K
  R205 R212: value: 20K
  R206 R213: value: 220R
  R208 R214 R216 R218 R221 R223: value: 49R9
  R209 R210: value: 10R
  R215 R225: value: 2K
  R217 R222: value: 1K
  R224: value: 6K65/0,1%/10ppm
R211 = MCLRP12DTDRR018: 18mOhm, 3W, 0,5%, 50ppm/°C; Manufacturer: Milticomp; Class I: Pasiv; Class II: Shunt 3W; Best.-Nr.: Farnell: 282-8111; Last edited: 23.11.2010 14:12; value: 0.018R
R219 R220 = HVCB2512BDE1M00: Resistor SMD 1M/0,1%/3KV/2W/25ppm/°C; Class I: Pasiv; Best.-Nr.: DigiKey: HVCB2512BDE1M00CT-ND; Class II: Resistor; Last edited: 17.11.2006 11:38; value: 1M

## Sheet 1166V10-3.SchDoc: Half-Bridge Phase 2
size A3; Author: M. Kutzsche; Organization: Kübrich Ing.-Gesellschaft; Address1: mbH & Co. KG; Address2: Weißmühle 10; Address3: D-96170 Priesendorf; DocumentNumber: UltraZohm; Revision: 10; SheetNumber: 3; SheetTotal: 5
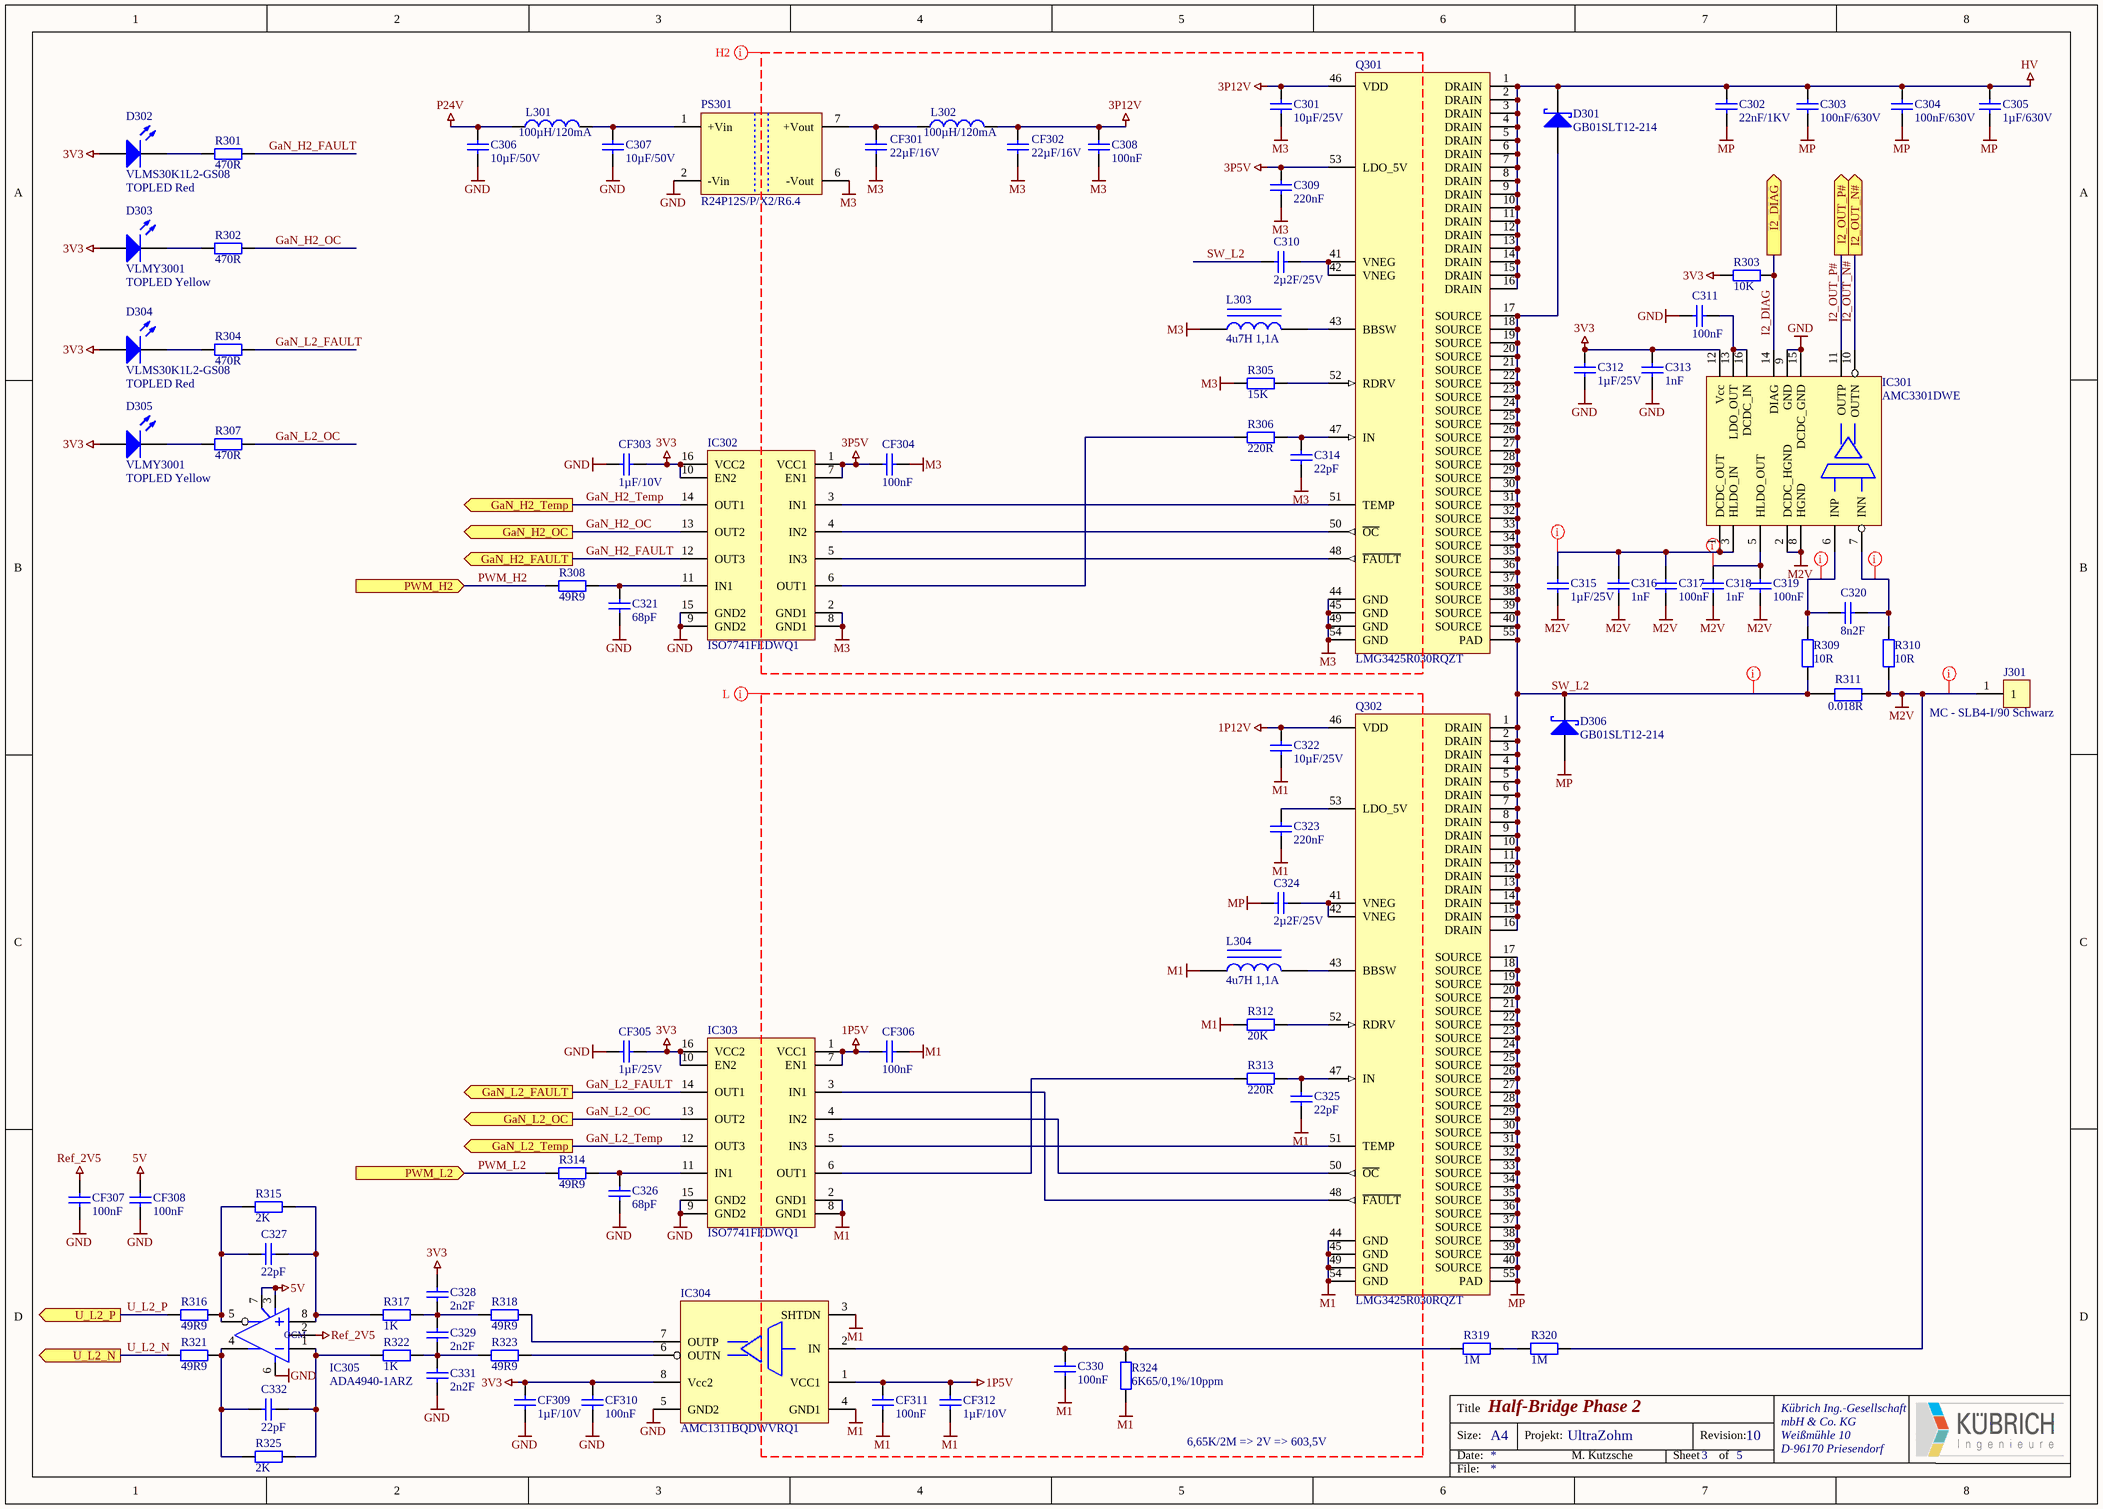
[diagram p2: 1166V10-3.SchDoc]

### Parts
C301  10µF/25V  [0805-Cap]
C302  22nF/1KV  [2220-Cap]
C303  100nF/630V  [2220-Cap]
C304  100nF/630V  [2220-Cap]
C305  1µF/630V  [2220-Cap]
C306  10µF/50V  [1206-Cap]
C307  10µF/50V  [1206-Cap]
C308  100nF  [0603-Cap]
C309  220nF  [0603-Cap]
C310  2µ2F/25V  [0805-Cap]
C311  100nF  [0603-Cap]
C312  1µF/25V  [1206-Cap]
C313  1nF  [1206-Cap]
C314  22pF  [0603-Cap]
C315  1µF/25V  [0603-Cap]
C316  1nF  [0603-Cap]
C317  100nF  [0603-Cap]
C318  1nF  [1206-Cap]
C319  100nF  [1206-Cap]
C320  8n2F  [0603-Cap]
C321  68pF  [0603-Cap]
C322  10µF/25V  [0805-Cap]
C323  220nF  [0603-Cap]
C324  2µ2F/25V  [0805-Cap]
C325  22pF  [0603-Cap]
C326  68pF  [0603-Cap]
C327  22pF  [0603-Cap]
C328  2n2F  [0603-Cap]
C329  2n2F  [0603-Cap]
C330  100nF  [0603-Cap]
C331  2n2F  [0603-Cap]
C332  22pF  [0603-Cap]
CF301  22µF/16V  [0805-Cap]
CF302  22µF/16V  [0805-Cap]
CF303  1µF/10V  [0603-Cap]
CF304  100nF  [0603-Cap]
CF305  1µF/25V  [0603-Cap]
CF306  100nF  [0603-Cap]
CF307  100nF  [0603-Cap]
CF308  100nF  [0603-Cap]
CF309  1µF/10V  [0603-Cap]
CF310  100nF  [0603-Cap]
CF311  100nF  [0603-Cap]
CF312  1µF/10V  [0603-Cap]
D301  GB01SLT12-214  [DO-214 (SMB)]
D302  VLMS30K1L2-GS08  Class II: TOPLED Red  [PLCC-2_rot]
D303  VLMY3001  Class II: TOPLED Yellow  [PLCC-2_gelb]
D304  VLMS30K1L2-GS08  Class II: TOPLED Red  [PLCC-2_rot]
D305  VLMY3001  Class II: TOPLED Yellow  [PLCC-2_gelb]
D306  GB01SLT12-214  [DO-214 (SMB)]
IC301  AMC3301DWE  [SOIC-16-W - 8.1mm]
IC302  ISO7741FEDWQ1  [SOIC-16-W - 8.1mm]
IC303  ISO7741FEDWQ1  [SOIC-16-W - 8.1mm]
IC304  AMC1311BQDWVRQ1  [SOIC-8-W]
IC305  ADA4940-1ARZ  [SOIC-8-N]
J301  MC - SLB4-I/90 Schwarz  [SLB4-I/90 - 4mm]
L301  100µH/120mA  [1007-IND (2518)]
L302  100µH/120mA  [1007-IND (2518)]
L303  4u7H 1,1A  [2.0mm x 1.6mm]
L304  4u7H 1,1A  [2.0mm x 1.6mm]
PS301  R24P12S/P/X2/R6.4  [SIP-7 Single - X2]
Q301  LMG3425R030RQZT  [VQFN-54 (RQZ0054)]
Q302  LMG3425R030RQZT  [VQFN-54 (RQZ0054)]
R301  470R  [0603-Res]
R302  470R  [0603-Res]
R303  10K  [0603-Res]
R304  470R  [0603-Res]
R305  15K  [0603-Res]
R306  220R  [0603-Res]
R307  470R  [0603-Res]
R308  49R9  [0603-Res]
R309  10R  [0603-Res]
R310  10R  [0603-Res]
R311  0.018R  [2512]
R312  20K  [0603-Res]
R313  220R  [0603-Res]
R314  49R9  [0603-Res]
R315  2K  [0603-Res]
R316  49R9  [0603-Res]
R317  1K  [0603-Res]
R318  49R9  [0603-Res]
R319  1M  [2512-Res]
R320  1M  [2512-Res]
R321  49R9  [0603-Res]
R322  1K  [0603-Res]
R323  49R9  [0603-Res]
R324  6K65/0,1%/10ppm  [0603-Res]
R325  2K  [0603-Res]

### Ports
GaN_H2_FAULT (out), GaN_H2_OC (out), GaN_H2_Temp (out), GaN_L2_FAULT (out), GaN_L2_OC (out), GaN_L2_Temp (out), I2_DIAG (out), I2_OUT_N# (out), I2_OUT_P# (out), PWM_H2 (in), PWM_L2 (in), U_L2_N (out), U_L2_P (out)

### Nets
1P5V: CF306.2 CF311.1 CF312.1 IC303.1(VCC1) IC303.7(EN1) IC304.1(VCC1)
1P12V: C322.2 Q302.46(VDD)
3P5V: C309.2 CF304.2 IC302.1(VCC1) IC302.7(EN1) Q301.53(LDO_5V)
3P12V: C301.2 C308.1 CF302.1 L302.2 Q301.46(VDD)
3V3: C312.1 C313.1 C328.2 CF303.1 CF305.1 CF309.1 CF310.1 D302.1(A) D303.1(A) D304.1(A) D305.1(A) IC301.12(Vcc) IC302.10(EN2) IC302.16(VCC2) IC303.10(EN2) IC303.16(VCC2) IC304.8(Vcc2) R303.2
5V: CF308.1 IC305.3(V+) IC305.7(EN)
GND: C306.1 C307.1 C311.1 C312.2 C313.2 C321.1 C326.1 C331.1 CF303.2 CF305.2 CF307.2 CF308.2 CF309.2 CF310.2 IC301.9(GND) IC301.15(DCDC_GND) IC302.9(GND2) IC302.15(GND2) IC303.9(GND2) IC303.15(GND2) IC304.5(GND2) IC305.6(V-) PS301.2(-Vin)
HV: C302.1 C303.1 C304.1 C305.1 D301.2(K) Q301.1(DRAIN) Q301.2(DRAIN) Q301.3(DRAIN) Q301.4(DRAIN) Q301.5(DRAIN) Q301.6(DRAIN) Q301.7(DRAIN) Q301.8(DRAIN) Q301.9(DRAIN) Q301.10(DRAIN) Q301.11(DRAIN) Q301.12(DRAIN) Q301.13(DRAIN) Q301.14(DRAIN) Q301.15(DRAIN) Q301.16(DRAIN)
M1: C322.1 C323.1 C325.1 C330.1 CF306.1 CF311.2 CF312.2 IC303.2(GND1) IC303.8(GND1) IC304.3(SHTDN) IC304.4(GND1) L304.1 Q302.44(GND) Q302.45(GND) Q302.49(GND) Q302.54(GND) R312.2 R324.2
M2V: C315.2 C316.2 C317.2 C318.2 C319.2 IC301.2(DCDC_HGND) IC301.8(HGND) J301.1 R310.1 R311.2 R320.2
M3: C301.1 C308.2 C309.1 C314.1 CF301.2 CF302.2 CF304.1 IC302.2(GND1) IC302.8(GND1) L303.1 PS301.6(-Vout) Q301.44(GND) Q301.45(GND) Q301.49(GND) Q301.54(GND) R305.2
MP: C302.2 C303.2 C304.2 C305.2 C324.2 D306.1(A) Q302.17(SOURCE) Q302.18(SOURCE) Q302.19(SOURCE) Q302.20(SOURCE) Q302.21(SOURCE) Q302.22(SOURCE) Q302.23(SOURCE) Q302.24(SOURCE) Q302.25(SOURCE) Q302.26(SOURCE) Q302.27(SOURCE) Q302.28(SOURCE) Q302.29(SOURCE) Q302.30(SOURCE) Q302.31(SOURCE) Q302.32(SOURCE) Q302.33(SOURCE) Q302.34(SOURCE) Q302.35(SOURCE) Q302.36(SOURCE) Q302.37(SOURCE) Q302.38(SOURCE) Q302.39(SOURCE) Q302.40(SOURCE) Q302.55(PAD)
P24V: C306.2 L301.1
Ref_2V5: CF307.1 IC305.2(OCM)
GaN_H2_FAULT: IC302.12(OUT3) R301.2 ; port GaN_H2_FAULT
GaN_H2_OC: IC302.13(OUT2) R302.2 ; port GaN_H2_OC
GaN_H2_Temp: IC302.14(OUT1) ; port GaN_H2_Temp
GaN_L2_FAULT: IC303.14(OUT1) R304.2 ; port GaN_L2_FAULT
GaN_L2_OC: IC303.13(OUT2) R307.2 ; port GaN_L2_OC
GaN_L2_Temp: IC303.12(OUT3) ; port GaN_L2_Temp
I2_DIAG: IC301.14(DIAG) R303.1 ; port I2_DIAG
I2_OUT_N#: IC301.10(OUTN) ; port I2_OUT_N#
I2_OUT_P#: IC301.11(OUTP) ; port I2_OUT_P#
PWM_H2: R308.2 ; port PWM_H2
PWM_L2: R314.2 ; port PWM_L2
SW_L2: C310.2 D301.1(A) D306.2(K) Q301.17(SOURCE) Q301.18(SOURCE) Q301.19(SOURCE) Q301.20(SOURCE) Q301.21(SOURCE) Q301.22(SOURCE) Q301.23(SOURCE) Q301.24(SOURCE) Q301.25(SOURCE) Q301.26(SOURCE) Q301.27(SOURCE) Q301.28(SOURCE) Q301.29(SOURCE) Q301.30(SOURCE) Q301.31(SOURCE) Q301.32(SOURCE) Q301.33(SOURCE) Q301.34(SOURCE) Q301.35(SOURCE) Q301.36(SOURCE) Q301.37(SOURCE) Q301.38(SOURCE) Q301.39(SOURCE) Q301.40(SOURCE) Q301.55(PAD) Q302.1(DRAIN) Q302.2(DRAIN) Q302.3(DRAIN) Q302.4(DRAIN) Q302.5(DRAIN) Q302.6(DRAIN) Q302.7(DRAIN) Q302.8(DRAIN) Q302.9(DRAIN) Q302.10(DRAIN) Q302.11(DRAIN) Q302.12(DRAIN) Q302.13(DRAIN) Q302.14(DRAIN) Q302.15(DRAIN) Q302.16(DRAIN) R309.1 R311.1
U_L2_N: R321.2 ; port U_L2_N
U_L2_P: R316.2 ; port U_L2_P
NetC307_2: C307.2 L301.2 PS301.1(+Vin)
NetC310_1: C310.1 Q301.41(VNEG) Q301.42(VNEG)
NetC311_2: C311.2 IC301.13(LDO_OUT) IC301.16(DCDC_IN)
NetC314_2: C314.2 Q301.47(IN) R306.1
NetC315_1: C315.1 C316.1 C317.1 IC301.1(DCDC_OUT) IC301.3(HLDO_IN)
NetC318_1: C318.1 C319.1 IC301.5(HLDO_OUT)
NetC320_1: C320.1 IC301.7(INN) R310.2
NetC320_2: C320.2 IC301.6(INP) R309.2
NetC321_2: C321.2 IC302.11(IN1) R308.1
NetC323_2: C323.2 Q302.53(LDO_5V)
NetC324_1: C324.1 Q302.41(VNEG) Q302.42(VNEG)
NetC325_2: C325.2 Q302.47(IN) R313.1
NetC326_2: C326.2 IC303.11(IN1) R314.1
NetC327_1: C327.1 IC305.8(+) R315.1 R317.2
NetC327_2: C327.2 IC305.5(Out) R315.2 R316.1
NetC328_1: C328.1 C329.2 R317.1 R318.2
NetC329_1: C329.1 C331.2 R322.1 R323.2
NetC330_2: C330.2 IC304.2(IN) R319.1 R324.1
NetC332_1: C332.1 IC305.1(-) R322.2 R325.1
NetC332_2: C332.2 IC305.4(Out) R321.1 R325.2
NetCF301_1: CF301.1 L302.1 PS301.7(+Vout)
NetD302_2: D302.2(K) R301.1
NetD303_2: D303.2(K) R302.1
NetD304_2: D304.2(K) R304.1
NetD305_2: D305.2(K) R307.1
NetIC302_3: IC302.3(IN1) Q301.51(TEMP)
NetIC302_4: IC302.4(IN2) Q301.50(~{OC})
NetIC302_5: IC302.5(IN3) Q301.48(~{FAULT})
NetIC302_6: IC302.6(OUT1) R306.2
NetIC303_3: IC303.3(IN1) Q302.48(~{FAULT})
NetIC303_4: IC303.4(IN2) Q302.50(~{OC})
NetIC303_5: IC303.5(IN3) Q302.51(TEMP)
NetIC303_6: IC303.6(OUT1) R313.2
NetIC304_6: IC304.6(OUTN) R323.1
NetIC304_7: IC304.7(OUTP) R318.1
NetL303_2: L303.2 Q301.43(BBSW)
NetL304_2: L304.2 Q302.43(BBSW)
NetQ301_52: Q301.52(RDRV) R305.1
NetQ302_52: Q302.52(RDRV) R312.1
NetR319_2: R319.2 R320.1

### Layout directives
net class H2: 3P5V, 3P12V, M2V, M3, NetC315_1, NetC318_1, NetC320_1, NetC320_2, SW_L2
net class L: 1P5V, 1P12V, M1, MP

### Notes on the sheet
- 6,65K/2M => 2V => 603,5V
- Title
- Size:
- Date:
- A4
- Projekt:
- Sheet
- Revision:
- of
- File:

### Library data of the parts
C301-C332 CF301-CF312 = Cap_SMD: Capacitor (SMD); Class I: Pasiv; Class II: Capacitor; Last edited: 20.11.2006 10:25
  C301 C322: value: 10µF/25V
  C302: value: 22nF/1KV
  C303 C304: value: 100nF/630V
  C305: value: 1µF/630V
  C306 C307: value: 10µF/50V
  C308 C311 C317 C319 C330 CF304 CF306-CF308 CF310 CF311: value: 100nF
  C309 C323: value: 220nF
  C310 C324: value: 2µ2F/25V
  C312 C315 CF305: value: 1µF/25V
  C313 C316 C318: value: 1nF
  C314 C325 C327 C332: value: 22pF
  C320: value: 8n2F
  C321 C326: value: 68pF
  C328 C329 C331: value: 2n2F
  CF301 CF302: value: 22µF/16V
  CF303 CF309 CF312: value: 1µF/10V
D301 D306 = GB01SLT12-214: as D201 on sheet 1166V10-2; Class II: Silicon Carbide Schottky Diode Vr=1200V If=1A; Datasheet: Ver. 7 Nov 2000; Package reference: DO-214AA (SMB)
D302 D304 = VLMS30K1L2-GS08: as D202 on sheet 1166V10-2; Last edited: 23.01.2007 08:58
D303 D305 = VLMY3001: as D203 on sheet 1166V10-2; Last edited: 23.01.2007 08:58
IC301 = AMC3301DWE: as IC201 on sheet 1166V10-2; Class I: Isolated Amplifier; Datasheet: Unknown; Package reference: SOIC-16-W
IC302 IC303 = ISO7741FEDWQ1: as IC202 on sheet 1166V10-2; Class II: Quad-CH 100Mbps Isolators 1 IN/3 OUT, 5000V Reinforced, (-40-150°C); Datasheet: Unknown; Package reference: SOIC-16W
IC304 = AMC1311BQDWVRQ1: as IC205 on sheet 1166V10-2; Class I: Isolated Amplifier; Datasheet: Unknown; Package reference: SOIC-8-W
IC305 = ADA4940-1ARZ: as IC206 on sheet 1166V10-2; Class II: Fully Differential ADC Drivers (-40-125°C); Datasheet: DSO11449, Ver. Aug 2000; Last edited: 04.01.2007 10:14; Package Reference: SOIC-N-8
J301 = MC - SLB4-I/90 Schwarz: as J201 on sheet 1166V10-2; Class II: Labor Winkelbuchsen 4mm Schwarz; Last edited: 07.03.2007 13:28
L301 L302 = CB2518T101K: as L201 on sheet 1166V10-2; Class II: 100µH, 60/120mA. (1007), -40-105°C; Last edited: 08.12.2006 12:28
L303 L304 = SDEM20161T-4R7MS: as L203 on sheet 1166V10-2; Class II: Power Choke 4u7H 1,1A; Last edited: 15.03.2007 11:19
PS301 = R24P12S/P/X2/R6.4: as PS201 on sheet 1166V10-2; Class II: DC/DC Converter 24V to 12V, 1W, 84mA (unregulated) 6,4KVDC Rainforced; Package reference: SIP-7; Datasheet: Rev. 28 Apr 2002
Q301 Q302 = LMG3425R030RQZT: as Q201 on sheet 1166V10-2; Class II: GaN FET Power Stage With Cycle-by-cycle Overcurrent Protection 600V/40A/30mOhm; Datasheet: LMG3425R030; Package reference: VQFN-32
R301-R310 R312-R318 R321-R325 = Res_SMD: Resistor SMD; Class I: Pasiv; Class II: Resistor; Last edited: 17.11.2006 11:38
  R301 R302 R304 R307: value: 470R
  R303: value: 10K
  R305: value: 15K
  R306 R313: value: 220R
  R308 R314 R316 R318 R321 R323: value: 49R9
  R309 R310: value: 10R
  R312: value: 20K
  R315 R325: value: 2K
  R317 R322: value: 1K
  R324: value: 6K65/0,1%/10ppm
R311 = MCLRP12DTDRR018: as R211 on sheet 1166V10-2; Last edited: 23.11.2010 14:12; value: 0.018R
R319 R320 = HVCB2512BDE1M00: as R219 on sheet 1166V10-2; Class II: Resistor; Last edited: 17.11.2006 11:38; value: 1M

## Sheet 1166V10-4.SchDoc: Half-Bridge Phase 3
size A3; Author: M. Kutzsche; Organization: Kübrich Ing.-Gesellschaft; Address1: mbH & Co. KG; Address2: Weißmühle 10; Address3: D-96170 Priesendorf; DocumentNumber: UltraZohm; Revision: 10; SheetNumber: 4; SheetTotal: 5
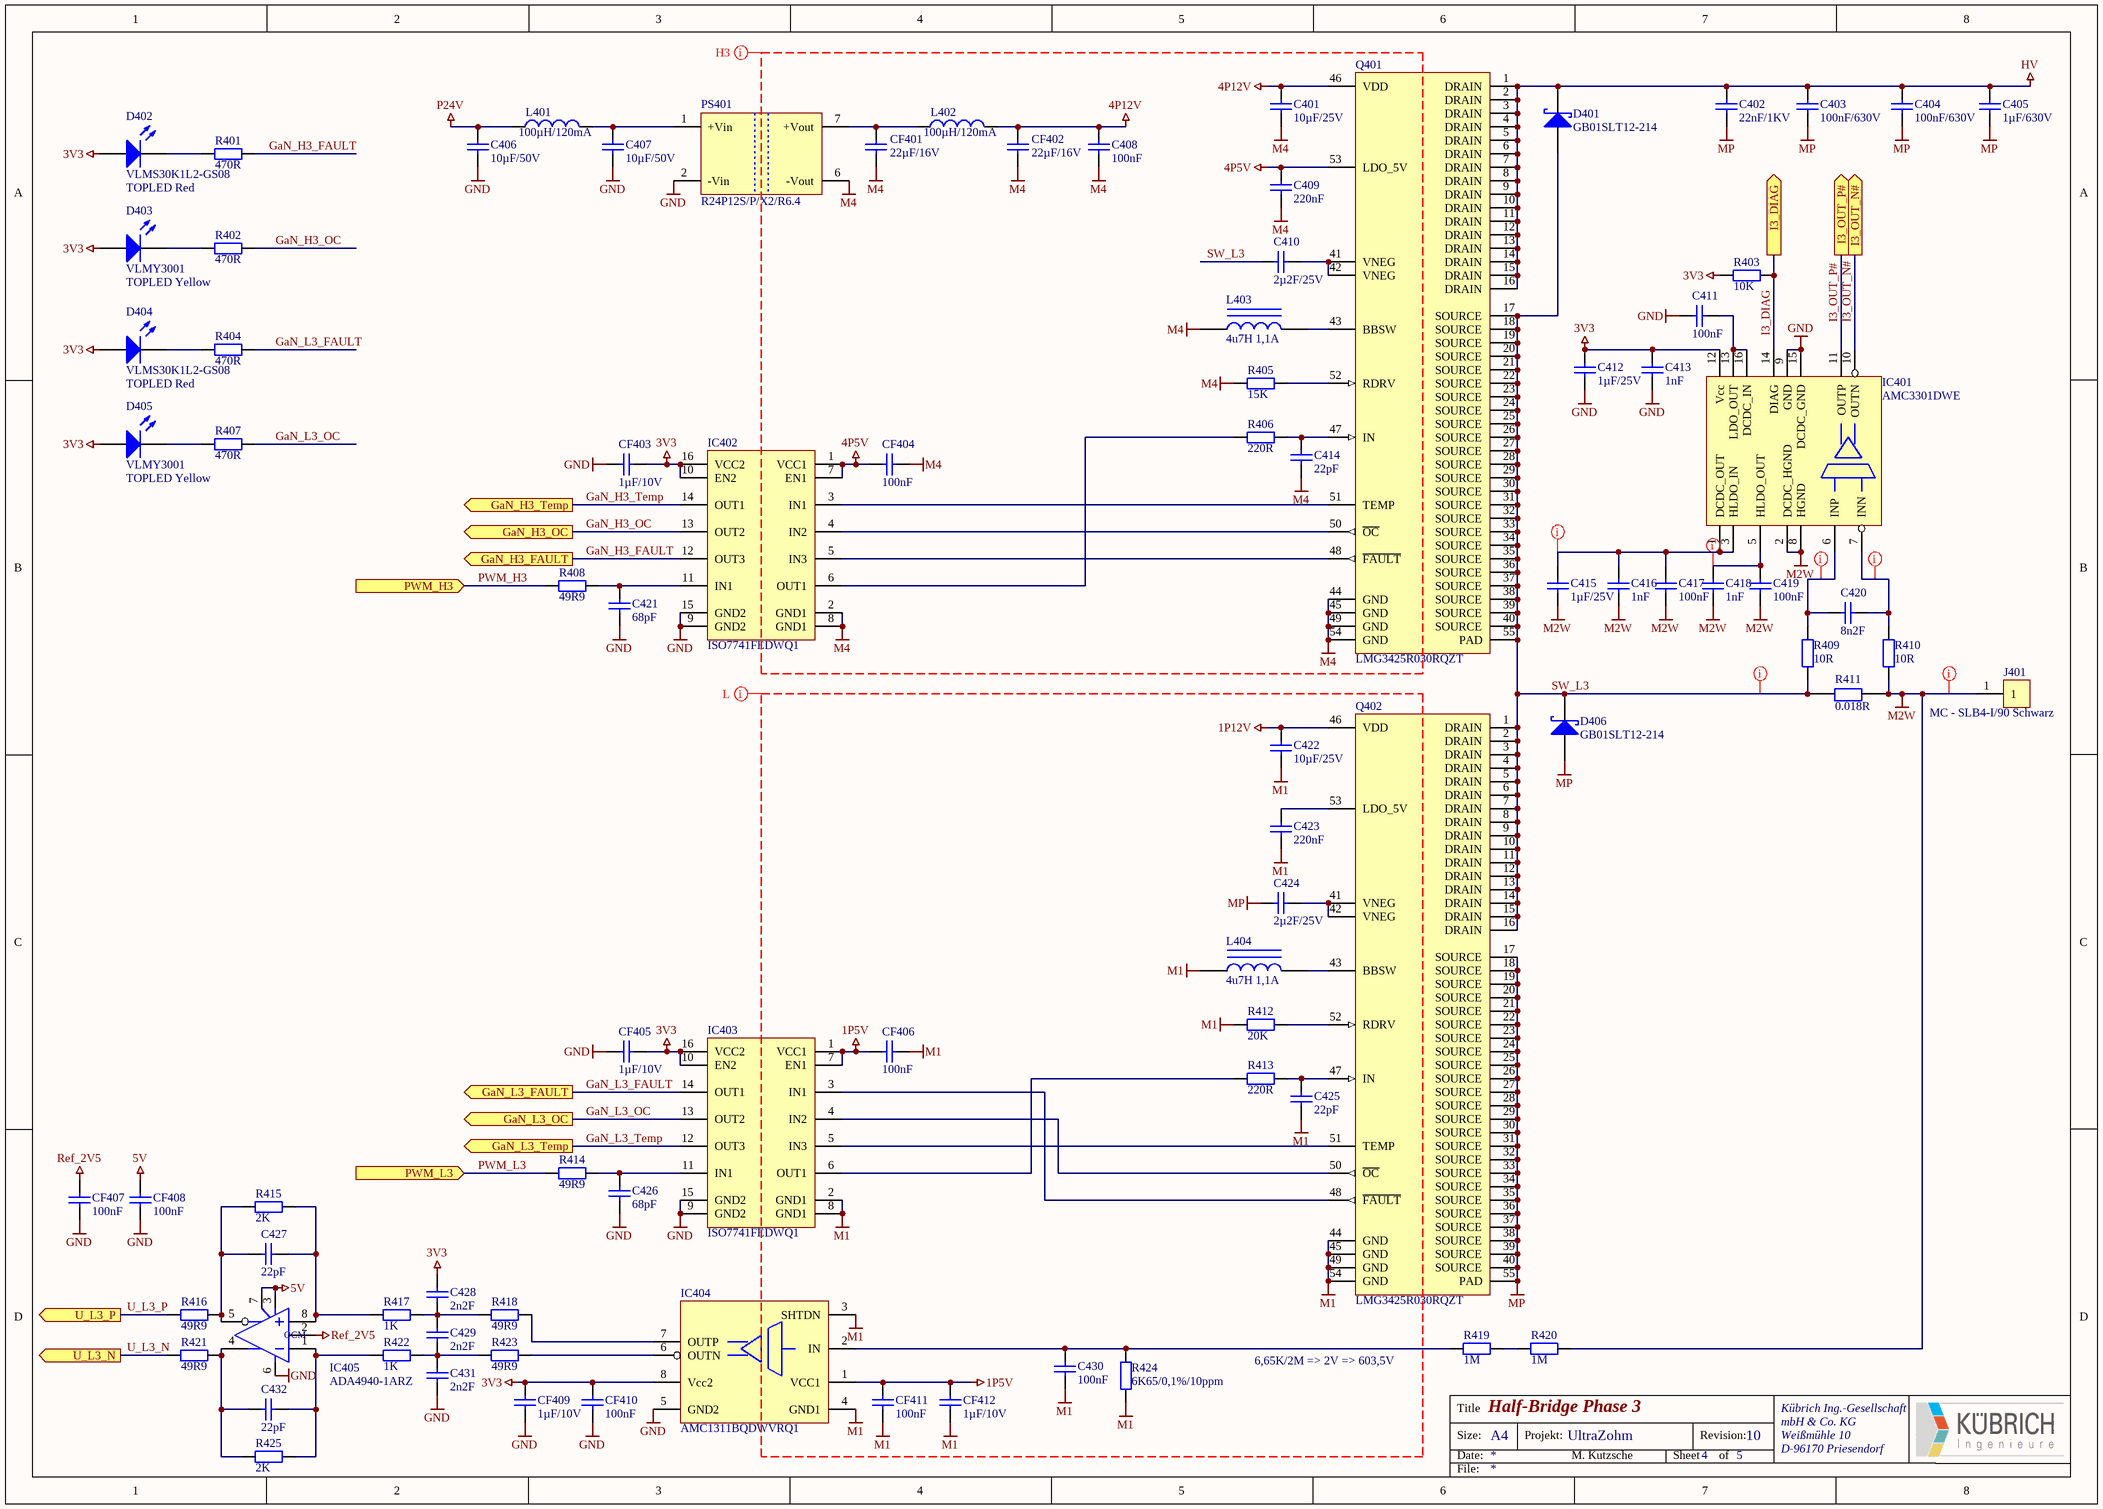
[diagram p3: 1166V10-4.SchDoc]

### Parts
C401  10µF/25V  [0805-Cap]
C402  22nF/1KV  [2220-Cap]
C403  100nF/630V  [2220-Cap]
C404  100nF/630V  [2220-Cap]
C405  1µF/630V  [2220-Cap]
C406  10µF/50V  [1206-Cap]
C407  10µF/50V  [1206-Cap]
C408  100nF  [0603-Cap]
C409  220nF  [0603-Cap]
C410  2µ2F/25V  [0805-Cap]
C411  100nF  [0603-Cap]
C412  1µF/25V  [1206-Cap]
C413  1nF  [1206-Cap]
C414  22pF  [0603-Cap]
C415  1µF/25V  [0603-Cap]
C416  1nF  [0603-Cap]
C417  100nF  [0603-Cap]
C418  1nF  [1206-Cap]
C419  100nF  [1206-Cap]
C420  8n2F  [0603-Cap]
C421  68pF  [0603-Cap]
C422  10µF/25V  [0805-Cap]
C423  220nF  [0603-Cap]
C424  2µ2F/25V  [0805-Cap]
C425  22pF  [0603-Cap]
C426  68pF  [0603-Cap]
C427  22pF  [0603-Cap]
C428  2n2F  [0603-Cap]
C429  2n2F  [0603-Cap]
C430  100nF  [0603-Cap]
C431  2n2F  [0603-Cap]
C432  22pF  [0603-Cap]
CF401  22µF/16V  [0805-Cap]
CF402  22µF/16V  [0805-Cap]
CF403  1µF/10V  [0603-Cap]
CF404  100nF  [0603-Cap]
CF405  1µF/10V  [0603-Cap]
CF406  100nF  [0603-Cap]
CF407  100nF  [0603-Cap]
CF408  100nF  [0603-Cap]
CF409  1µF/10V  [0603-Cap]
CF410  100nF  [0603-Cap]
CF411  100nF  [0603-Cap]
CF412  1µF/10V  [0603-Cap]
D401  GB01SLT12-214  [DO-214 (SMB)]
D402  VLMS30K1L2-GS08  Class II: TOPLED Red  [PLCC-2_rot]
D403  VLMY3001  Class II: TOPLED Yellow  [PLCC-2_gelb]
D404  VLMS30K1L2-GS08  Class II: TOPLED Red  [PLCC-2_rot]
D405  VLMY3001  Class II: TOPLED Yellow  [PLCC-2_gelb]
D406  GB01SLT12-214  [DO-214 (SMB)]
IC401  AMC3301DWE  [SOIC-16-W - 8.1mm]
IC402  ISO7741FEDWQ1  [SOIC-16-W - 8.1mm]
IC403  ISO7741FEDWQ1  [SOIC-16-W - 8.1mm]
IC404  AMC1311BQDWVRQ1  [SOIC-8-W]
IC405  ADA4940-1ARZ  [SOIC-8-N]
J401  MC - SLB4-I/90 Schwarz  [SLB4-I/90 - 4mm]
L401  100µH/120mA  [1007-IND (2518)]
L402  100µH/120mA  [1007-IND (2518)]
L403  4u7H 1,1A  [2.0mm x 1.6mm]
L404  4u7H 1,1A  [2.0mm x 1.6mm]
PS401  R24P12S/P/X2/R6.4  [SIP-7 Single - X2]
Q401  LMG3425R030RQZT  [VQFN-54 (RQZ0054)]
Q402  LMG3425R030RQZT  [VQFN-54 (RQZ0054)]
R401  470R  [0603-Res]
R402  470R  [0603-Res]
R403  10K  [0603-Res]
R404  470R  [0603-Res]
R405  15K  [0603-Res]
R406  220R  [0603-Res]
R407  470R  [0603-Res]
R408  49R9  [0603-Res]
R409  10R  [0603-Res]
R410  10R  [0603-Res]
R411  0.018R  [2512]
R412  20K  [0603-Res]
R413  220R  [0603-Res]
R414  49R9  [0603-Res]
R415  2K  [0603-Res]
R416  49R9  [0603-Res]
R417  1K  [0603-Res]
R418  49R9  [0603-Res]
R419  1M  [2512-Res]
R420  1M  [2512-Res]
R421  49R9  [0603-Res]
R422  1K  [0603-Res]
R423  49R9  [0603-Res]
R424  6K65/0,1%/10ppm  [0603-Res]
R425  2K  [0603-Res]

### Ports
GaN_H3_FAULT (out), GaN_H3_OC (out), GaN_H3_Temp (out), GaN_L3_FAULT (out), GaN_L3_OC (out), GaN_L3_Temp (out), I3_DIAG (out), I3_OUT_N# (out), I3_OUT_P# (out), PWM_H3 (in), PWM_L3 (in), U_L3_N (out), U_L3_P (out)

### Nets
1P5V: CF406.2 CF411.1 CF412.1 IC403.1(VCC1) IC403.7(EN1) IC404.1(VCC1)
1P12V: C422.2 Q402.46(VDD)
3V3: C412.1 C413.1 C428.2 CF403.1 CF405.1 CF409.1 CF410.1 D402.1(A) D403.1(A) D404.1(A) D405.1(A) IC401.12(Vcc) IC402.10(EN2) IC402.16(VCC2) IC403.10(EN2) IC403.16(VCC2) IC404.8(Vcc2) R403.2
4P5V: C409.2 CF404.2 IC402.1(VCC1) IC402.7(EN1) Q401.53(LDO_5V)
4P12V: C401.2 C408.1 CF402.1 L402.2 Q401.46(VDD)
5V: CF408.1 IC405.3(V+) IC405.7(EN)
GND: C406.1 C407.1 C411.1 C412.2 C413.2 C421.1 C426.1 C431.1 CF403.2 CF405.2 CF407.2 CF408.2 CF409.2 CF410.2 IC401.9(GND) IC401.15(DCDC_GND) IC402.9(GND2) IC402.15(GND2) IC403.9(GND2) IC403.15(GND2) IC404.5(GND2) IC405.6(V-) PS401.2(-Vin)
HV: C402.1 C403.1 C404.1 C405.1 D401.2(K) Q401.1(DRAIN) Q401.2(DRAIN) Q401.3(DRAIN) Q401.4(DRAIN) Q401.5(DRAIN) Q401.6(DRAIN) Q401.7(DRAIN) Q401.8(DRAIN) Q401.9(DRAIN) Q401.10(DRAIN) Q401.11(DRAIN) Q401.12(DRAIN) Q401.13(DRAIN) Q401.14(DRAIN) Q401.15(DRAIN) Q401.16(DRAIN)
M1: C422.1 C423.1 C425.1 C430.1 CF406.1 CF411.2 CF412.2 IC403.2(GND1) IC403.8(GND1) IC404.3(SHTDN) IC404.4(GND1) L404.1 Q402.44(GND) Q402.45(GND) Q402.49(GND) Q402.54(GND) R412.2 R424.2
M2W: C415.2 C416.2 C417.2 C418.2 C419.2 IC401.2(DCDC_HGND) IC401.8(HGND) J401.1 R410.1 R411.2 R420.2
M4: C401.1 C408.2 C409.1 C414.1 CF401.2 CF402.2 CF404.1 IC402.2(GND1) IC402.8(GND1) L403.1 PS401.6(-Vout) Q401.44(GND) Q401.45(GND) Q401.49(GND) Q401.54(GND) R405.2
MP: C402.2 C403.2 C404.2 C405.2 C424.2 D406.1(A) Q402.17(SOURCE) Q402.18(SOURCE) Q402.19(SOURCE) Q402.20(SOURCE) Q402.21(SOURCE) Q402.22(SOURCE) Q402.23(SOURCE) Q402.24(SOURCE) Q402.25(SOURCE) Q402.26(SOURCE) Q402.27(SOURCE) Q402.28(SOURCE) Q402.29(SOURCE) Q402.30(SOURCE) Q402.31(SOURCE) Q402.32(SOURCE) Q402.33(SOURCE) Q402.34(SOURCE) Q402.35(SOURCE) Q402.36(SOURCE) Q402.37(SOURCE) Q402.38(SOURCE) Q402.39(SOURCE) Q402.40(SOURCE) Q402.55(PAD)
P24V: C406.2 L401.1
Ref_2V5: CF407.1 IC405.2(OCM)
GaN_H3_FAULT: IC402.12(OUT3) R401.2 ; port GaN_H3_FAULT
GaN_H3_OC: IC402.13(OUT2) R402.2 ; port GaN_H3_OC
GaN_H3_Temp: IC402.14(OUT1) ; port GaN_H3_Temp
GaN_L3_FAULT: IC403.14(OUT1) R404.2 ; port GaN_L3_FAULT
GaN_L3_OC: IC403.13(OUT2) R407.2 ; port GaN_L3_OC
GaN_L3_Temp: IC403.12(OUT3) ; port GaN_L3_Temp
I3_DIAG: IC401.14(DIAG) R403.1 ; port I3_DIAG
I3_OUT_N#: IC401.10(OUTN) ; port I3_OUT_N#
I3_OUT_P#: IC401.11(OUTP) ; port I3_OUT_P#
PWM_H3: R408.2 ; port PWM_H3
PWM_L3: R414.2 ; port PWM_L3
SW_L3: C410.2 D401.1(A) D406.2(K) Q401.17(SOURCE) Q401.18(SOURCE) Q401.19(SOURCE) Q401.20(SOURCE) Q401.21(SOURCE) Q401.22(SOURCE) Q401.23(SOURCE) Q401.24(SOURCE) Q401.25(SOURCE) Q401.26(SOURCE) Q401.27(SOURCE) Q401.28(SOURCE) Q401.29(SOURCE) Q401.30(SOURCE) Q401.31(SOURCE) Q401.32(SOURCE) Q401.33(SOURCE) Q401.34(SOURCE) Q401.35(SOURCE) Q401.36(SOURCE) Q401.37(SOURCE) Q401.38(SOURCE) Q401.39(SOURCE) Q401.40(SOURCE) Q401.55(PAD) Q402.1(DRAIN) Q402.2(DRAIN) Q402.3(DRAIN) Q402.4(DRAIN) Q402.5(DRAIN) Q402.6(DRAIN) Q402.7(DRAIN) Q402.8(DRAIN) Q402.9(DRAIN) Q402.10(DRAIN) Q402.11(DRAIN) Q402.12(DRAIN) Q402.13(DRAIN) Q402.14(DRAIN) Q402.15(DRAIN) Q402.16(DRAIN) R409.1 R411.1
U_L3_N: R421.2 ; port U_L3_N
U_L3_P: R416.2 ; port U_L3_P
NetC407_2: C407.2 L401.2 PS401.1(+Vin)
NetC410_1: C410.1 Q401.41(VNEG) Q401.42(VNEG)
NetC411_2: C411.2 IC401.13(LDO_OUT) IC401.16(DCDC_IN)
NetC414_2: C414.2 Q401.47(IN) R406.1
NetC415_1: C415.1 C416.1 C417.1 IC401.1(DCDC_OUT) IC401.3(HLDO_IN)
NetC418_1: C418.1 C419.1 IC401.5(HLDO_OUT)
NetC420_1: C420.1 IC401.7(INN) R410.2
NetC420_2: C420.2 IC401.6(INP) R409.2
NetC421_2: C421.2 IC402.11(IN1) R408.1
NetC423_2: C423.2 Q402.53(LDO_5V)
NetC424_1: C424.1 Q402.41(VNEG) Q402.42(VNEG)
NetC425_2: C425.2 Q402.47(IN) R413.1
NetC426_2: C426.2 IC403.11(IN1) R414.1
NetC427_1: C427.1 IC405.8(+) R415.1 R417.2
NetC427_2: C427.2 IC405.5(Out) R415.2 R416.1
NetC428_1: C428.1 C429.2 R417.1 R418.2
NetC429_1: C429.1 C431.2 R422.1 R423.2
NetC430_2: C430.2 IC404.2(IN) R419.1 R424.1
NetC432_1: C432.1 IC405.1(-) R422.2 R425.1
NetC432_2: C432.2 IC405.4(Out) R421.1 R425.2
NetCF401_1: CF401.1 L402.1 PS401.7(+Vout)
NetD402_2: D402.2(K) R401.1
NetD403_2: D403.2(K) R402.1
NetD404_2: D404.2(K) R404.1
NetD405_2: D405.2(K) R407.1
NetIC402_3: IC402.3(IN1) Q401.51(TEMP)
NetIC402_4: IC402.4(IN2) Q401.50(~{OC})
NetIC402_5: IC402.5(IN3) Q401.48(~{FAULT})
NetIC402_6: IC402.6(OUT1) R406.2
NetIC403_3: IC403.3(IN1) Q402.48(~{FAULT})
NetIC403_4: IC403.4(IN2) Q402.50(~{OC})
NetIC403_5: IC403.5(IN3) Q402.51(TEMP)
NetIC403_6: IC403.6(OUT1) R413.2
NetIC404_6: IC404.6(OUTN) R423.1
NetIC404_7: IC404.7(OUTP) R418.1
NetL403_2: L403.2 Q401.43(BBSW)
NetL404_2: L404.2 Q402.43(BBSW)
NetQ401_52: Q401.52(RDRV) R405.1
NetQ402_52: Q402.52(RDRV) R412.1
NetR419_2: R419.2 R420.1

### Layout directives
net class H3: 4P5V, 4P12V, M2W, M4, NetC415_1, NetC418_1, NetC420_1, NetC420_2, SW_L3
net class L: 1P5V, 1P12V, M1, MP

### Notes on the sheet
- 6,65K/2M => 2V => 603,5V
- Title
- Size:
- Date:
- A4
- Projekt:
- Sheet
- Revision:
- of
- File:

### Library data of the parts
C401-C432 CF401-CF412 = Cap_SMD: Capacitor (SMD); Class I: Pasiv; Class II: Capacitor; Last edited: 20.11.2006 10:25
  C401 C422: value: 10µF/25V
  C402: value: 22nF/1KV
  C403 C404: value: 100nF/630V
  C405: value: 1µF/630V
  C406 C407: value: 10µF/50V
  C408 C411 C417 C419 C430 CF404 CF406-CF408 CF410 CF411: value: 100nF
  C409 C423: value: 220nF
  C410 C424: value: 2µ2F/25V
  C412 C415: value: 1µF/25V
  C413 C416 C418: value: 1nF
  C414 C425 C427 C432: value: 22pF
  C420: value: 8n2F
  C421 C426: value: 68pF
  C428 C429 C431: value: 2n2F
  CF401 CF402: value: 22µF/16V
  CF403 CF405 CF409 CF412: value: 1µF/10V
D401 D406 = GB01SLT12-214: as D201 on sheet 1166V10-2; Class II: Silicon Carbide Schottky Diode Vr=1200V If=1A; Datasheet: Ver. 7 Nov 2000; Package reference: DO-214AA (SMB)
D402 D404 = VLMS30K1L2-GS08: as D202 on sheet 1166V10-2; Last edited: 23.01.2007 08:58
D403 D405 = VLMY3001: as D203 on sheet 1166V10-2; Last edited: 23.01.2007 08:58
IC401 = AMC3301DWE: as IC201 on sheet 1166V10-2; Class I: Isolated Amplifier; Datasheet: Unknown; Package reference: SOIC-16-W
IC402 IC403 = ISO7741FEDWQ1: as IC202 on sheet 1166V10-2; Class II: Quad-CH 100Mbps Isolators 1 IN/3 OUT, 5000V Reinforced, (-40-150°C); Datasheet: Unknown; Package reference: SOIC-16W
IC404 = AMC1311BQDWVRQ1: as IC205 on sheet 1166V10-2; Class I: Isolated Amplifier; Datasheet: Unknown; Package reference: SOIC-8-W
IC405 = ADA4940-1ARZ: as IC206 on sheet 1166V10-2; Class II: Fully Differential ADC Drivers (-40-125°C); Datasheet: DSO11449, Ver. Aug 2000; Last edited: 04.01.2007 10:14; Package Reference: SOIC-N-8
J401 = MC - SLB4-I/90 Schwarz: as J201 on sheet 1166V10-2; Class II: Labor Winkelbuchsen 4mm Schwarz; Last edited: 07.03.2007 13:28
L401 L402 = CB2518T101K: as L201 on sheet 1166V10-2; Class II: 100µH, 60/120mA. (1007), -40-105°C; Last edited: 08.12.2006 12:28
L403 L404 = SDEM20161T-4R7MS: as L203 on sheet 1166V10-2; Class II: Power Choke 4u7H 1,1A; Last edited: 15.03.2007 11:19
PS401 = R24P12S/P/X2/R6.4: as PS201 on sheet 1166V10-2; Class II: DC/DC Converter 24V to 12V, 1W, 84mA (unregulated) 6,4KVDC Rainforced; Package reference: SIP-7; Datasheet: Rev. 28 Apr 2002
Q401 Q402 = LMG3425R030RQZT: as Q201 on sheet 1166V10-2; Class II: GaN FET Power Stage With Cycle-by-cycle Overcurrent Protection 600V/40A/30mOhm; Datasheet: LMG3425R030; Package reference: VQFN-32
R401-R410 R412-R418 R421-R425 = Res_SMD: Resistor SMD; Class I: Pasiv; Class II: Resistor; Last edited: 17.11.2006 11:38
  R401 R402 R404 R407: value: 470R
  R403: value: 10K
  R405: value: 15K
  R406 R413: value: 220R
  R408 R414 R416 R418 R421 R423: value: 49R9
  R409 R410: value: 10R
  R412: value: 20K
  R415 R425: value: 2K
  R417 R422: value: 1K
  R424: value: 6K65/0,1%/10ppm
R411 = MCLRP12DTDRR018: as R211 on sheet 1166V10-2; Last edited: 23.11.2010 14:12; value: 0.018R
R419 R420 = HVCB2512BDE1M00: as R219 on sheet 1166V10-2; Class II: Resistor; Last edited: 17.11.2006 11:38; value: 1M